# EAGLE schematic CPU (EAGLE 7.5.0), part 1 of 7
RISC CPU
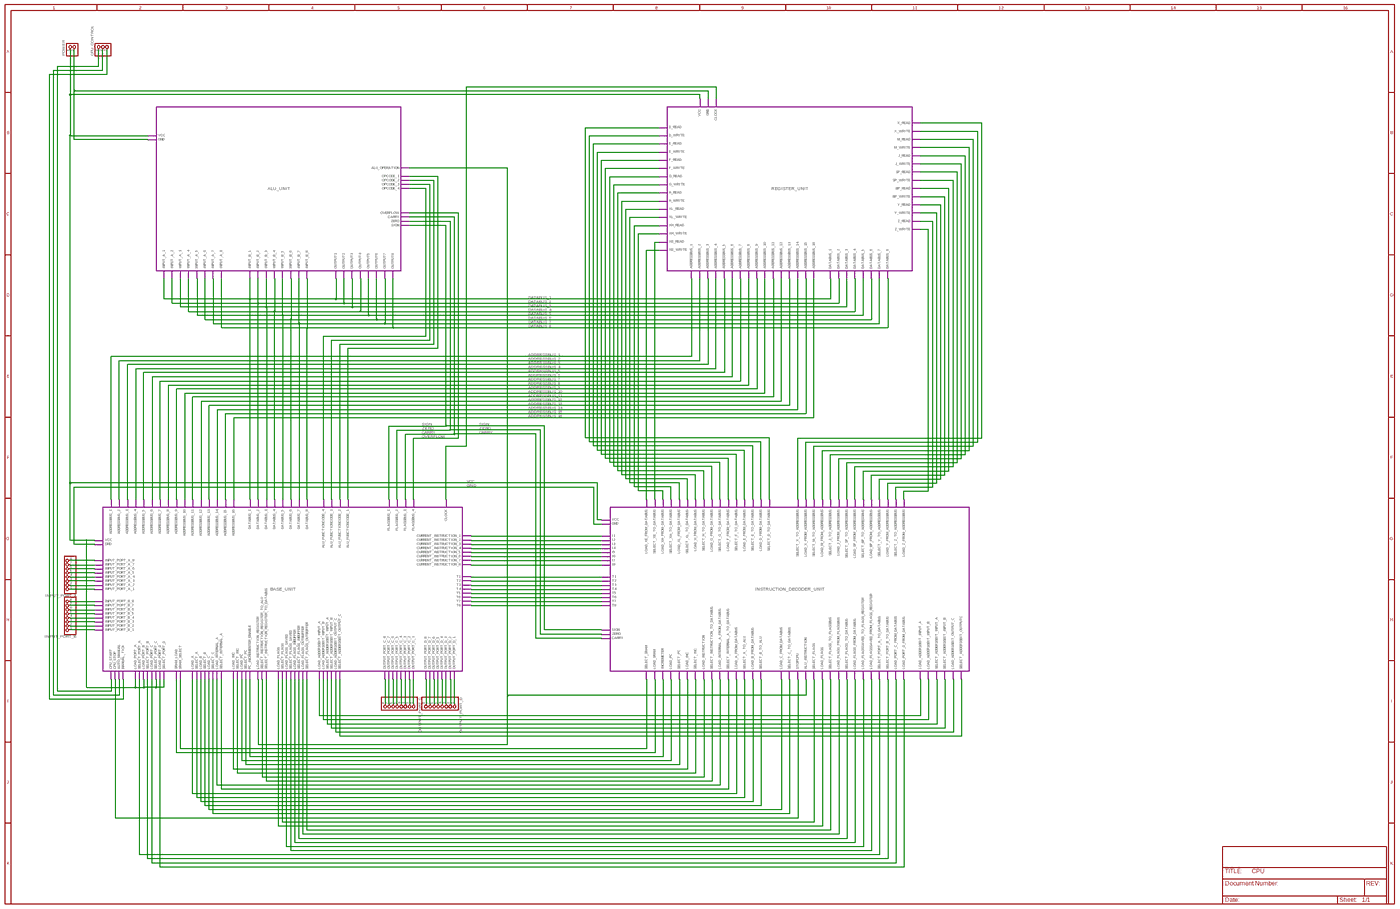
[diagram p0: schematic, sheet 1, overview]
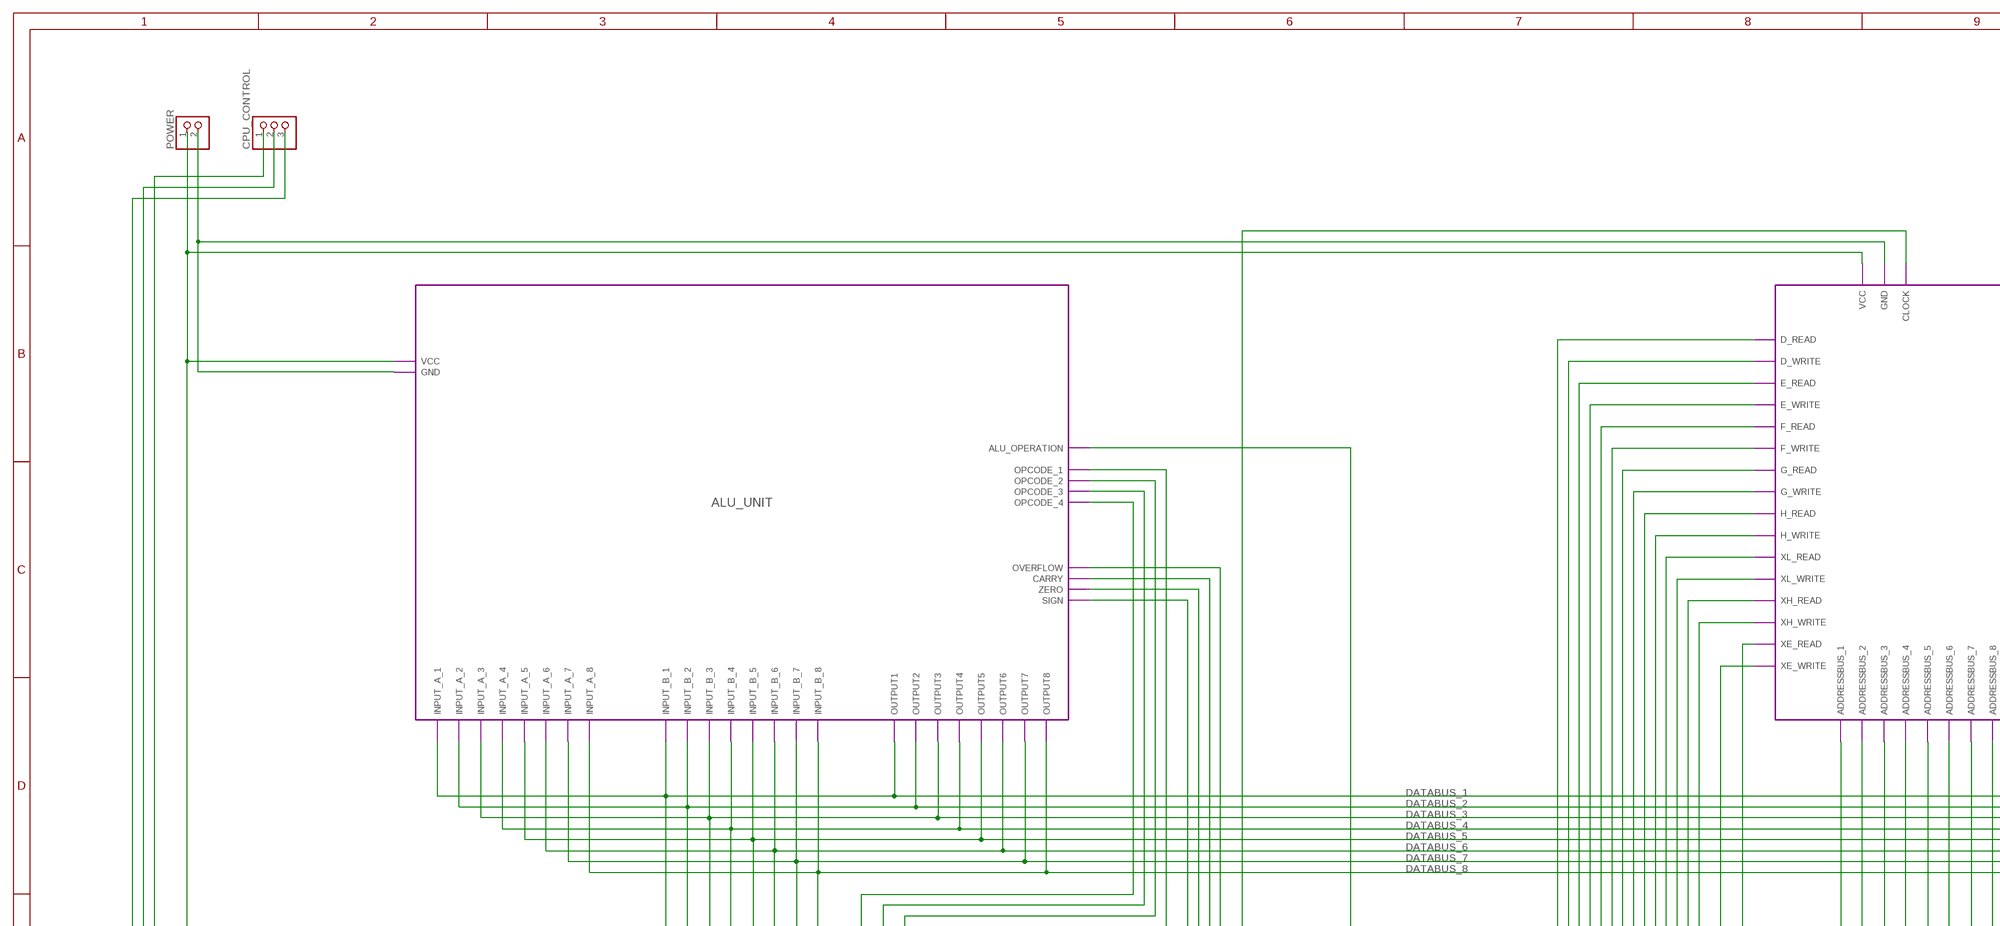
[diagram p1: schematic, sheet 1, part 1 of 4]
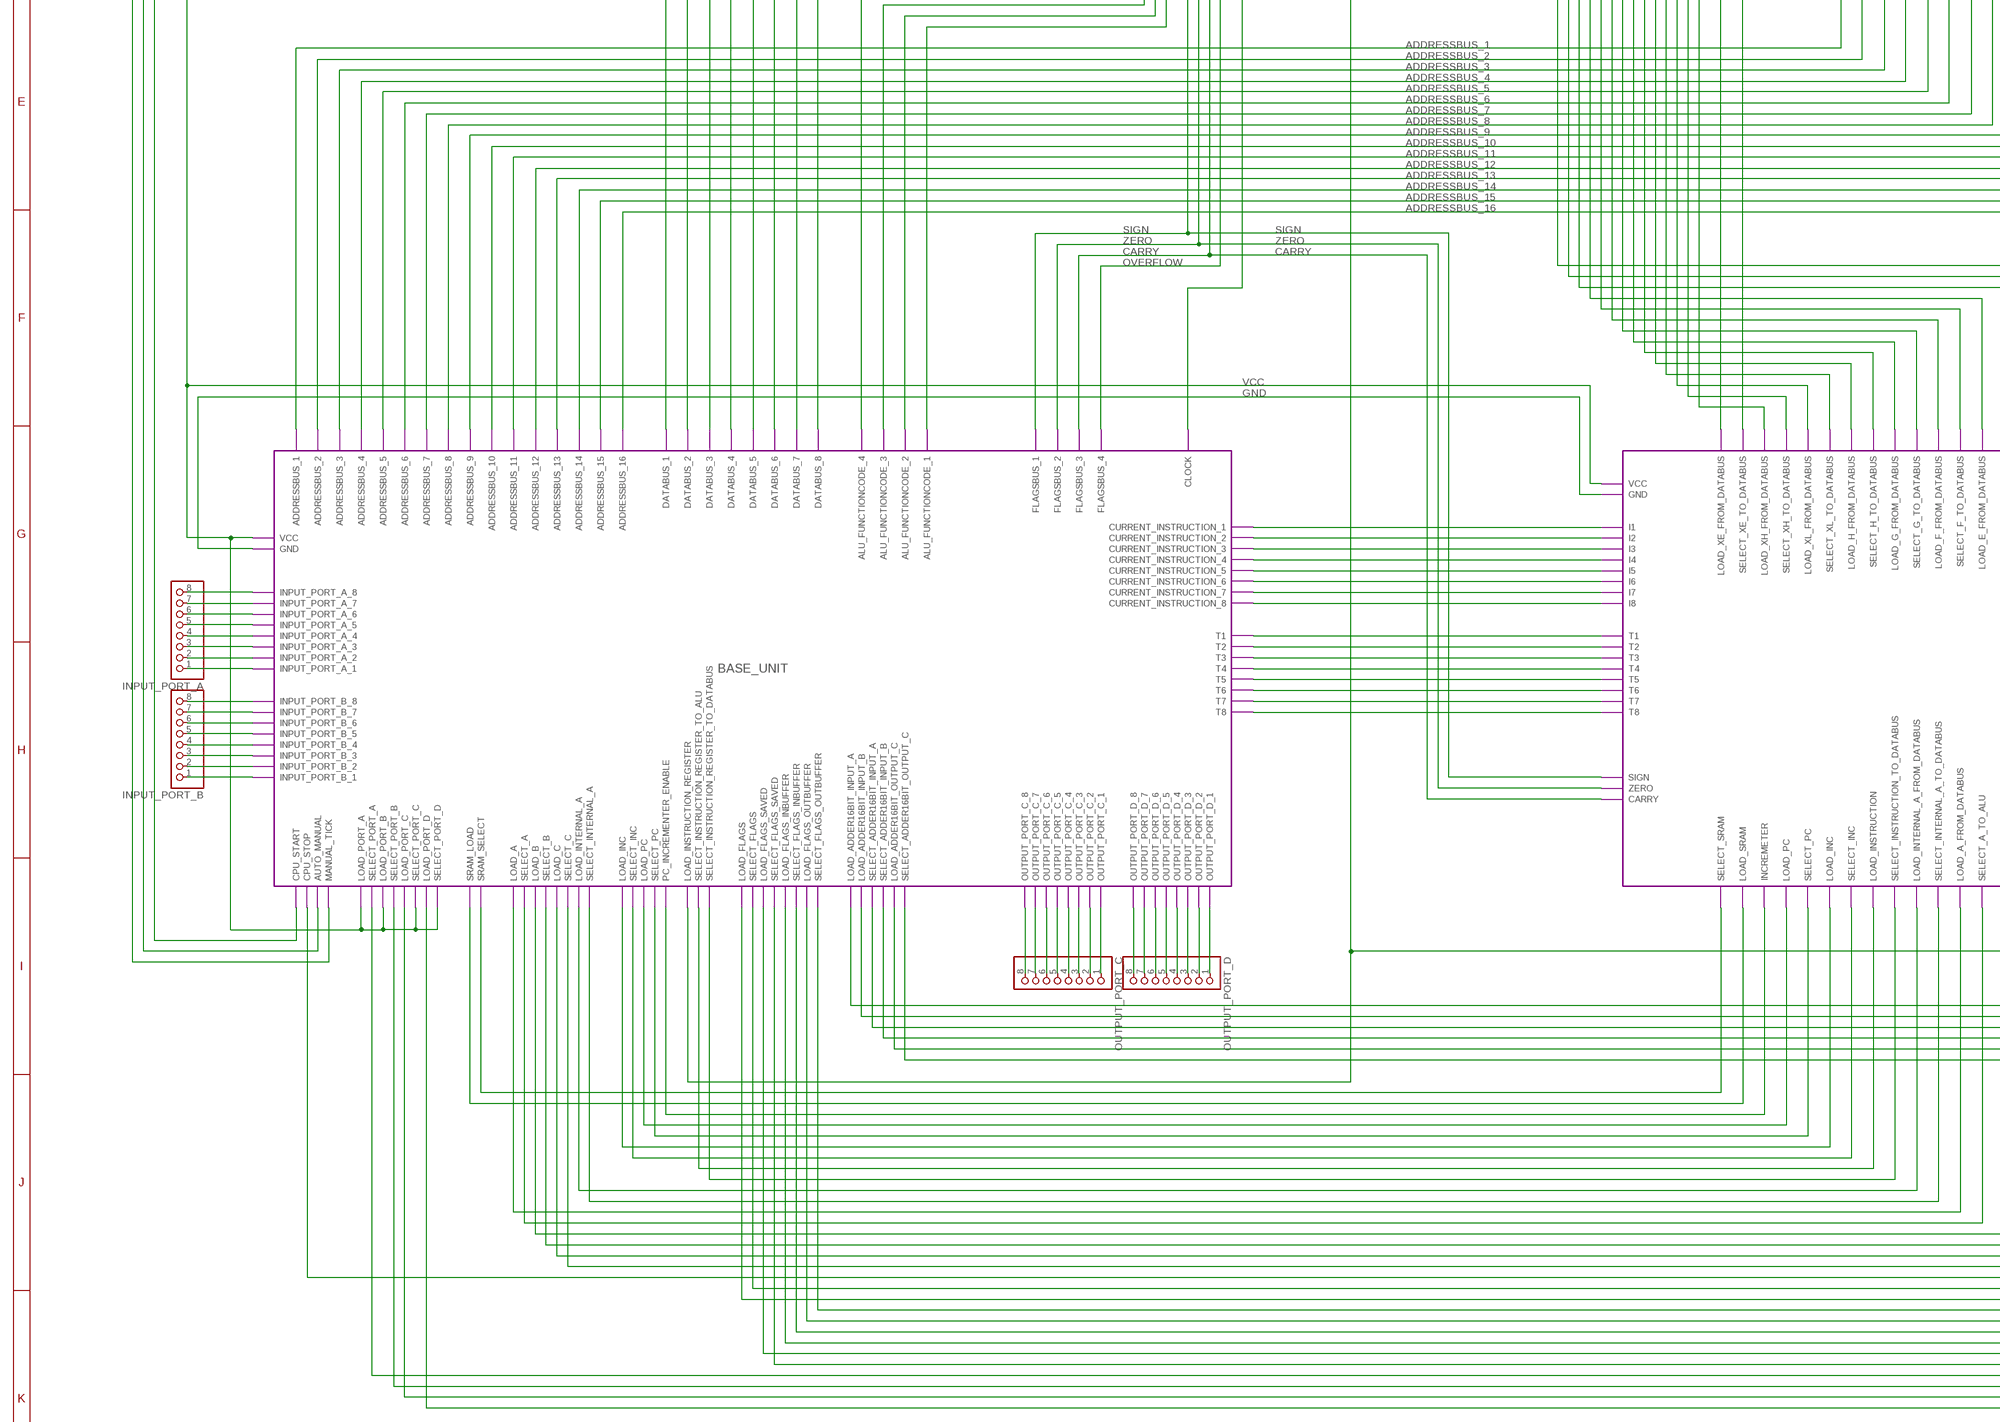
[diagram p2: schematic, sheet 1, part 2 of 4]
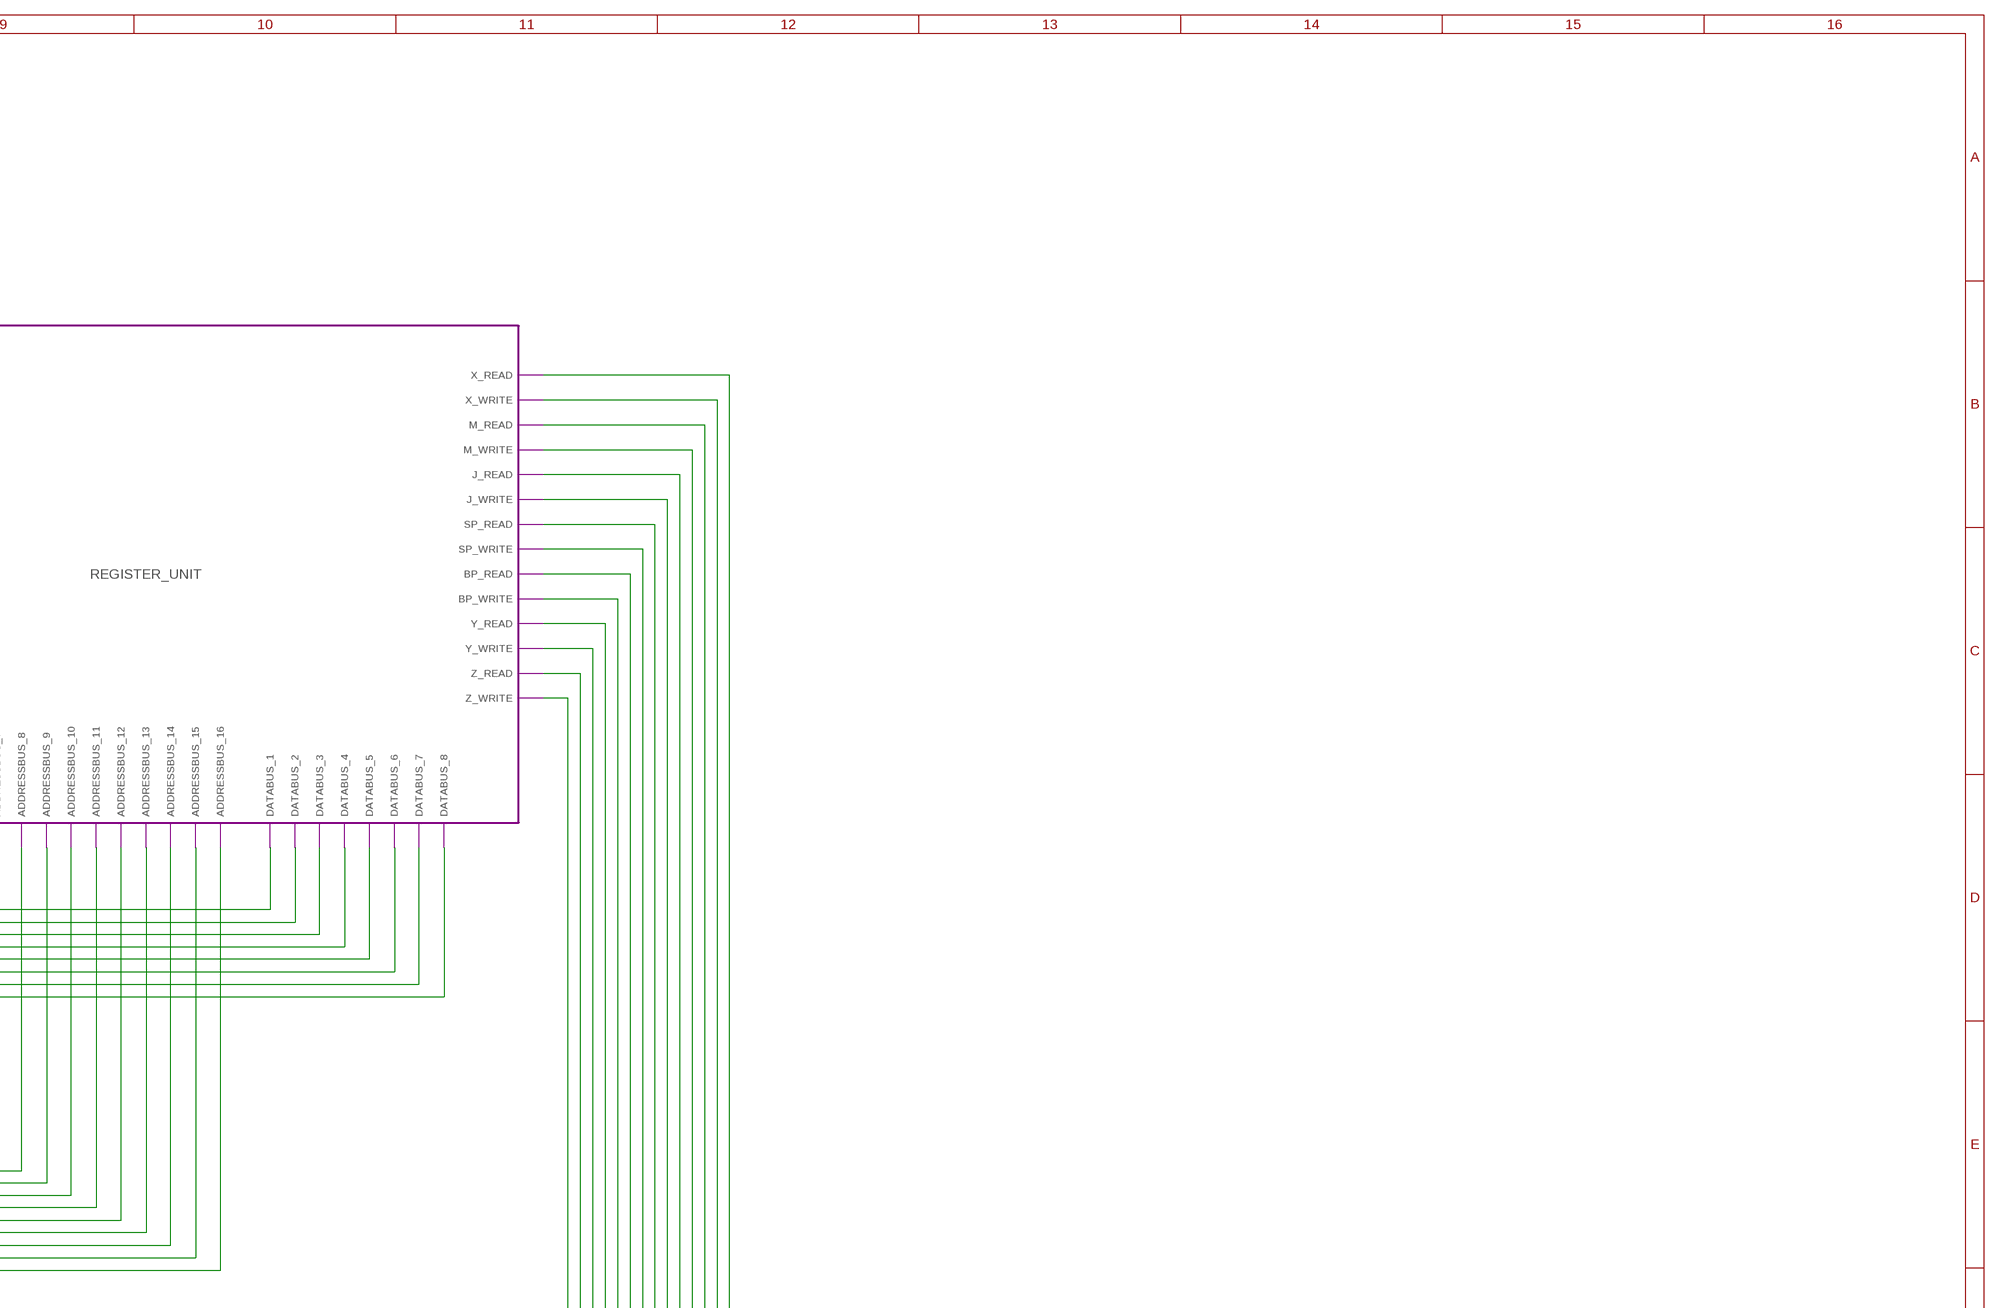
[diagram p3: schematic, sheet 1, part 3 of 4]
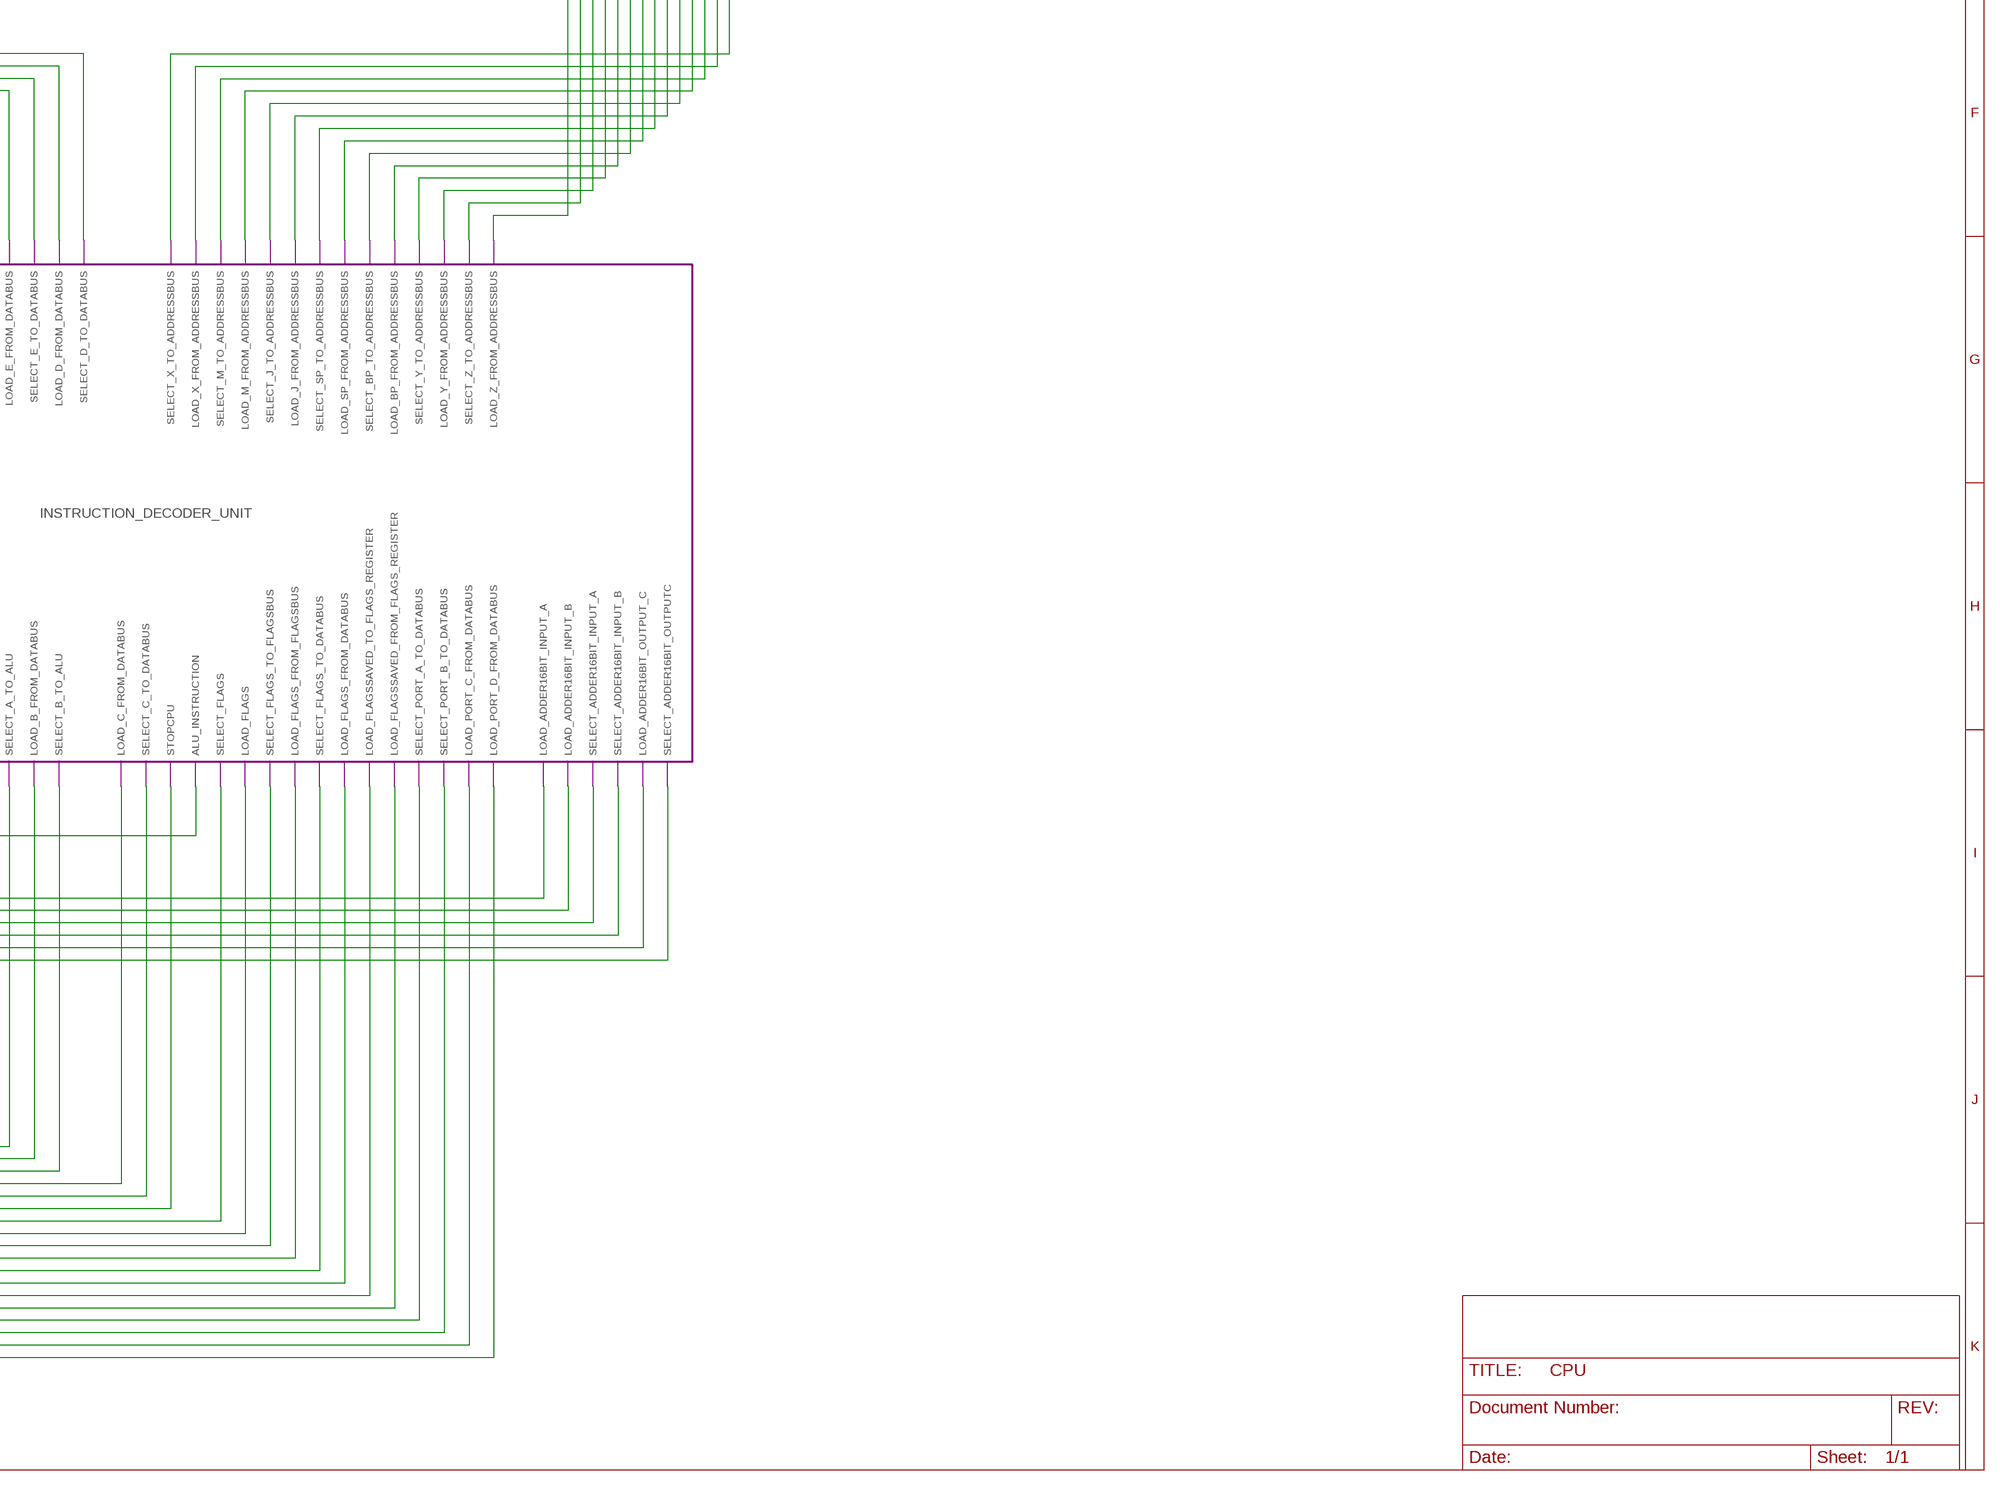
[diagram p4: schematic, sheet 1, part 4 of 4]

## Parts
CPU_CONTROL  PINHD-1X3  [1X03]
INPUT_PORT_A  PINHD-1X8  [1X08]
INPUT_PORT_B  PINHD-1X8  [1X08]
OUTPUT_PORT_C  PINHD-1X8  [1X08]
OUTPUT_PORT_D  PINHD-1X8  [1X08]
POWER  PINHD-1X2  [1X02]

## Module instances
REGISTER_UNIT = REGISTER_UNIT
ALU_UNIT = ALU
INSTRUCTION_DECODER_UNIT = INSTRUCTION_DECODER
BASE_UNIT = BASE

## Nets
ADDRESSBUS_1: port BASE_UNIT.ADDRESSBUS_1 REGISTER_UNIT.ADDRESSBUS_1
ADDRESSBUS_2: port BASE_UNIT.ADDRESSBUS_2 REGISTER_UNIT.ADDRESSBUS_2
ADDRESSBUS_3: port BASE_UNIT.ADDRESSBUS_3 REGISTER_UNIT.ADDRESSBUS_3
ADDRESSBUS_4: port BASE_UNIT.ADDRESSBUS_4 REGISTER_UNIT.ADDRESSBUS_4
ADDRESSBUS_5: port BASE_UNIT.ADDRESSBUS_5 REGISTER_UNIT.ADDRESSBUS_5
ADDRESSBUS_6: port BASE_UNIT.ADDRESSBUS_6 REGISTER_UNIT.ADDRESSBUS_6
ADDRESSBUS_7: port BASE_UNIT.ADDRESSBUS_7 REGISTER_UNIT.ADDRESSBUS_7
ADDRESSBUS_8: port BASE_UNIT.ADDRESSBUS_8 REGISTER_UNIT.ADDRESSBUS_8
ADDRESSBUS_9: port BASE_UNIT.ADDRESSBUS_9 REGISTER_UNIT.ADDRESSBUS_9
ADDRESSBUS_10: port BASE_UNIT.ADDRESSBUS_10 REGISTER_UNIT.ADDRESSBUS_10
ADDRESSBUS_11: port BASE_UNIT.ADDRESSBUS_11 REGISTER_UNIT.ADDRESSBUS_11
ADDRESSBUS_12: port BASE_UNIT.ADDRESSBUS_12 REGISTER_UNIT.ADDRESSBUS_12
ADDRESSBUS_13: port BASE_UNIT.ADDRESSBUS_13 REGISTER_UNIT.ADDRESSBUS_13
ADDRESSBUS_14: port BASE_UNIT.ADDRESSBUS_14 REGISTER_UNIT.ADDRESSBUS_14
ADDRESSBUS_15: port BASE_UNIT.ADDRESSBUS_15 REGISTER_UNIT.ADDRESSBUS_15
ADDRESSBUS_16: port BASE_UNIT.ADDRESSBUS_16 REGISTER_UNIT.ADDRESSBUS_16
AUTO_MANUAL: CPU_CONTROL.2 ; port BASE_UNIT.AUTO_MANUAL
CARRY: port BASE_UNIT.FLAGSBUS_3 ALU_UNIT.CARRY INSTRUCTION_DECODER_UNIT.CARRY
CPU_START: CPU_CONTROL.1 ; port BASE_UNIT.CPU_START
DATABUS_1: port ALU_UNIT.INPUT_A_1 ALU_UNIT.INPUT_B_1 ALU_UNIT.OUTPUT1 BASE_UNIT.DATABUS_1 REGISTER_UNIT.DATABUS_1
DATABUS_2: port ALU_UNIT.INPUT_A_2 ALU_UNIT.INPUT_B_2 ALU_UNIT.OUTPUT2 BASE_UNIT.DATABUS_2 REGISTER_UNIT.DATABUS_2
DATABUS_3: port ALU_UNIT.INPUT_A_3 ALU_UNIT.INPUT_B_3 ALU_UNIT.OUTPUT3 BASE_UNIT.DATABUS_3 REGISTER_UNIT.DATABUS_3
DATABUS_4: port ALU_UNIT.INPUT_A_4 ALU_UNIT.INPUT_B_4 ALU_UNIT.OUTPUT4 BASE_UNIT.DATABUS_4 REGISTER_UNIT.DATABUS_4
DATABUS_5: port ALU_UNIT.INPUT_A_5 ALU_UNIT.INPUT_B_5 ALU_UNIT.OUTPUT5 BASE_UNIT.DATABUS_5 REGISTER_UNIT.DATABUS_5
DATABUS_6: port ALU_UNIT.INPUT_A_6 ALU_UNIT.INPUT_B_6 ALU_UNIT.OUTPUT6 BASE_UNIT.DATABUS_6 REGISTER_UNIT.DATABUS_6
DATABUS_7: port ALU_UNIT.INPUT_A_7 ALU_UNIT.INPUT_B_7 ALU_UNIT.OUTPUT7 BASE_UNIT.DATABUS_7 REGISTER_UNIT.DATABUS_7
DATABUS_8: port ALU_UNIT.INPUT_A_8 ALU_UNIT.INPUT_B_8 ALU_UNIT.OUTPUT8 BASE_UNIT.DATABUS_8 REGISTER_UNIT.DATABUS_8
GND: port BASE_UNIT.GND INSTRUCTION_DECODER_UNIT.GND
INPUT_PORT_A_1: INPUT_PORT_A.1 ; port BASE_UNIT.INPUT_PORT_A_1
INPUT_PORT_A_2: INPUT_PORT_A.2 ; port BASE_UNIT.INPUT_PORT_A_2
INPUT_PORT_A_3: INPUT_PORT_A.3 ; port BASE_UNIT.INPUT_PORT_A_3
INPUT_PORT_A_4: INPUT_PORT_A.4 ; port BASE_UNIT.INPUT_PORT_A_4
INPUT_PORT_A_5: INPUT_PORT_A.5 ; port BASE_UNIT.INPUT_PORT_A_5
INPUT_PORT_A_6: INPUT_PORT_A.6 ; port BASE_UNIT.INPUT_PORT_A_6
INPUT_PORT_A_7: INPUT_PORT_A.7 ; port BASE_UNIT.INPUT_PORT_A_7
INPUT_PORT_A_8: INPUT_PORT_A.8 ; port BASE_UNIT.INPUT_PORT_A_8
INPUT_PORT_B_1: INPUT_PORT_B.1 ; port BASE_UNIT.INPUT_PORT_B_1
INPUT_PORT_B_2: INPUT_PORT_B.2 ; port BASE_UNIT.INPUT_PORT_B_2
INPUT_PORT_B_3: INPUT_PORT_B.3 ; port BASE_UNIT.INPUT_PORT_B_3
INPUT_PORT_B_4: INPUT_PORT_B.4 ; port BASE_UNIT.INPUT_PORT_B_4
INPUT_PORT_B_5: INPUT_PORT_B.5 ; port BASE_UNIT.INPUT_PORT_B_5
INPUT_PORT_B_6: INPUT_PORT_B.6 ; port BASE_UNIT.INPUT_PORT_B_6
INPUT_PORT_B_7: INPUT_PORT_B.7 ; port BASE_UNIT.INPUT_PORT_B_7
INPUT_PORT_B_8: INPUT_PORT_B.8 ; port BASE_UNIT.INPUT_PORT_B_8
MANUAL_TICK: CPU_CONTROL.3 ; port BASE_UNIT.MANUAL_TICK
N$1: port BASE_UNIT.CURRENT_INSTRUCTION_1 INSTRUCTION_DECODER_UNIT.I1
N$2: port BASE_UNIT.CURRENT_INSTRUCTION_2 INSTRUCTION_DECODER_UNIT.I2
N$3: port BASE_UNIT.CURRENT_INSTRUCTION_3 INSTRUCTION_DECODER_UNIT.I3
N$4: port BASE_UNIT.CURRENT_INSTRUCTION_4 INSTRUCTION_DECODER_UNIT.I4
N$5: port BASE_UNIT.CURRENT_INSTRUCTION_5 INSTRUCTION_DECODER_UNIT.I5
N$6: port BASE_UNIT.CURRENT_INSTRUCTION_6 INSTRUCTION_DECODER_UNIT.I6
N$7: port BASE_UNIT.CURRENT_INSTRUCTION_7 INSTRUCTION_DECODER_UNIT.I7
N$8: port BASE_UNIT.CURRENT_INSTRUCTION_8 INSTRUCTION_DECODER_UNIT.I8
N$9: port BASE_UNIT.T1 INSTRUCTION_DECODER_UNIT.T1
N$10: port BASE_UNIT.T2 INSTRUCTION_DECODER_UNIT.T2
N$11: port BASE_UNIT.T3 INSTRUCTION_DECODER_UNIT.T3
N$12: port BASE_UNIT.T4 INSTRUCTION_DECODER_UNIT.T4
N$13: port BASE_UNIT.T5 INSTRUCTION_DECODER_UNIT.T5
N$14: port BASE_UNIT.T6 INSTRUCTION_DECODER_UNIT.T6
N$15: port BASE_UNIT.T7 INSTRUCTION_DECODER_UNIT.T7
N$16: port BASE_UNIT.T8 INSTRUCTION_DECODER_UNIT.T8
N$17: POWER.2 ; port REGISTER_UNIT.GND ALU_UNIT.GND
N$73: port BASE_UNIT.ALU_FUNCTIONCODE_1 ALU_UNIT.OPCODE_1
N$74: port BASE_UNIT.ALU_FUNCTIONCODE_2 ALU_UNIT.OPCODE_2
N$75: port BASE_UNIT.ALU_FUNCTIONCODE_3 ALU_UNIT.OPCODE_3
N$76: port BASE_UNIT.ALU_FUNCTIONCODE_4 ALU_UNIT.OPCODE_4
N$81: port INSTRUCTION_DECODER_UNIT.LOAD_XE_FROM_DATABUS REGISTER_UNIT.XE_WRITE
N$82: port INSTRUCTION_DECODER_UNIT.SELECT_XE_TO_DATABUS REGISTER_UNIT.XE_READ
N$83: port INSTRUCTION_DECODER_UNIT.LOAD_XH_FROM_DATABUS REGISTER_UNIT.XH_WRITE
N$84: port INSTRUCTION_DECODER_UNIT.SELECT_XH_TO_DATABUS REGISTER_UNIT.XH_READ
N$85: port INSTRUCTION_DECODER_UNIT.LOAD_XL_FROM_DATABUS REGISTER_UNIT.XL_WRITE
N$86: port INSTRUCTION_DECODER_UNIT.SELECT_XL_TO_DATABUS REGISTER_UNIT.XL_READ
N$87: port INSTRUCTION_DECODER_UNIT.LOAD_H_FROM_DATABUS REGISTER_UNIT.H_WRITE
N$88: port INSTRUCTION_DECODER_UNIT.SELECT_H_TO_DATABUS REGISTER_UNIT.H_READ
N$89: port INSTRUCTION_DECODER_UNIT.LOAD_G_FROM_DATABUS REGISTER_UNIT.G_WRITE
N$90: port INSTRUCTION_DECODER_UNIT.SELECT_G_TO_DATABUS REGISTER_UNIT.G_READ
N$91: port INSTRUCTION_DECODER_UNIT.LOAD_F_FROM_DATABUS REGISTER_UNIT.F_WRITE
N$92: port INSTRUCTION_DECODER_UNIT.SELECT_F_TO_DATABUS REGISTER_UNIT.F_READ
N$93: port INSTRUCTION_DECODER_UNIT.LOAD_E_FROM_DATABUS REGISTER_UNIT.E_WRITE
N$94: port INSTRUCTION_DECODER_UNIT.SELECT_E_TO_DATABUS REGISTER_UNIT.E_READ
N$95: port INSTRUCTION_DECODER_UNIT.LOAD_D_FROM_DATABUS REGISTER_UNIT.D_WRITE
N$96: port INSTRUCTION_DECODER_UNIT.SELECT_D_TO_DATABUS REGISTER_UNIT.D_READ
N$97: port INSTRUCTION_DECODER_UNIT.LOAD_Z_FROM_ADDRESSBUS REGISTER_UNIT.Z_WRITE
N$98: port INSTRUCTION_DECODER_UNIT.SELECT_Z_TO_ADDRESSBUS REGISTER_UNIT.Z_READ
N$99: port INSTRUCTION_DECODER_UNIT.LOAD_Y_FROM_ADDRESSBUS REGISTER_UNIT.Y_WRITE
N$100: port INSTRUCTION_DECODER_UNIT.SELECT_Y_TO_ADDRESSBUS REGISTER_UNIT.Y_READ
N$101: port INSTRUCTION_DECODER_UNIT.LOAD_BP_FROM_ADDRESSBUS REGISTER_UNIT.BP_WRITE
N$102: port INSTRUCTION_DECODER_UNIT.SELECT_BP_TO_ADDRESSBUS REGISTER_UNIT.BP_READ
N$103: port INSTRUCTION_DECODER_UNIT.LOAD_SP_FROM_ADDRESSBUS REGISTER_UNIT.SP_WRITE
N$104: port INSTRUCTION_DECODER_UNIT.SELECT_SP_TO_ADDRESSBUS REGISTER_UNIT.SP_READ
N$105: port INSTRUCTION_DECODER_UNIT.LOAD_J_FROM_ADDRESSBUS REGISTER_UNIT.J_WRITE
N$106: port INSTRUCTION_DECODER_UNIT.SELECT_J_TO_ADDRESSBUS REGISTER_UNIT.J_READ
N$107: port INSTRUCTION_DECODER_UNIT.LOAD_M_FROM_ADDRESSBUS REGISTER_UNIT.M_WRITE
N$108: port INSTRUCTION_DECODER_UNIT.SELECT_M_TO_ADDRESSBUS REGISTER_UNIT.M_READ
N$109: port INSTRUCTION_DECODER_UNIT.LOAD_X_FROM_ADDRESSBUS REGISTER_UNIT.X_WRITE
N$110: port INSTRUCTION_DECODER_UNIT.SELECT_X_TO_ADDRESSBUS REGISTER_UNIT.X_READ
N$111: port BASE_UNIT.CLOCK REGISTER_UNIT.CLOCK
N$112: port INSTRUCTION_DECODER_UNIT.SELECT_SRAM BASE_UNIT.SRAM_SELECT
N$113: port INSTRUCTION_DECODER_UNIT.LOAD_SRAM BASE_UNIT.SRAM_LOAD
N$114: port INSTRUCTION_DECODER_UNIT.INCREMETER BASE_UNIT.PC_INCREMENTER_ENABLE
N$115: port INSTRUCTION_DECODER_UNIT.LOAD_PC BASE_UNIT.LOAD_PC
N$116: port INSTRUCTION_DECODER_UNIT.SELECT_PC BASE_UNIT.SELECT_PC
N$117: port INSTRUCTION_DECODER_UNIT.LOAD_INC BASE_UNIT.LOAD_INC
N$118: port INSTRUCTION_DECODER_UNIT.SELECT_INC BASE_UNIT.SELECT_INC
N$119: port INSTRUCTION_DECODER_UNIT.LOAD_INSTRUCTION BASE_UNIT.SELECT_INSTRUCTION_REGISTER_TO_ALU
N$120: port INSTRUCTION_DECODER_UNIT.SELECT_INSTRUCTION_TO_DATABUS BASE_UNIT.SELECT_INSTRUCTION_REGISTER_TO_DATABUS
N$121: port INSTRUCTION_DECODER_UNIT.LOAD_INTERNAL_A_FROM_DATABUS BASE_UNIT.LOAD_INTERNAL_A
N$122: port INSTRUCTION_DECODER_UNIT.SELECT_INTERNAL_A_TO_DATABUS BASE_UNIT.SELECT_INTERNAL_A
N$123: port INSTRUCTION_DECODER_UNIT.LOAD_A_FROM_DATABUS BASE_UNIT.LOAD_A
N$124: port INSTRUCTION_DECODER_UNIT.SELECT_A_TO_ALU BASE_UNIT.SELECT_A
N$125: port INSTRUCTION_DECODER_UNIT.LOAD_B_FROM_DATABUS BASE_UNIT.LOAD_B
N$126: port INSTRUCTION_DECODER_UNIT.SELECT_B_TO_ALU BASE_UNIT.SELECT_B
N$127: port INSTRUCTION_DECODER_UNIT.LOAD_C_FROM_DATABUS BASE_UNIT.LOAD_C
N$128: port INSTRUCTION_DECODER_UNIT.SELECT_C_TO_DATABUS BASE_UNIT.SELECT_C
N$129: port INSTRUCTION_DECODER_UNIT.STOPCPU BASE_UNIT.CPU_STOP
N$130: port INSTRUCTION_DECODER_UNIT.ALU_INSTRUCTION ALU_UNIT.ALU_OPERATION BASE_UNIT.LOAD_INSTRUCTION_REGISTER
N$131: port INSTRUCTION_DECODER_UNIT.SELECT_FLAGS BASE_UNIT.SELECT_FLAGS
N$132: port INSTRUCTION_DECODER_UNIT.LOAD_FLAGS BASE_UNIT.LOAD_FLAGS
N$133: port INSTRUCTION_DECODER_UNIT.SELECT_FLAGS_TO_FLAGSBUS BASE_UNIT.SELECT_FLAGS_OUTBUFFER
N$134: port INSTRUCTION_DECODER_UNIT.LOAD_FLAGS_FROM_FLAGSBUS BASE_UNIT.LOAD_FLAGS_OUTBUFFER
N$135: port INSTRUCTION_DECODER_UNIT.SELECT_FLAGS_TO_DATABUS BASE_UNIT.SELECT_FLAGS_INBUFFER
N$136: port INSTRUCTION_DECODER_UNIT.LOAD_FLAGS_FROM_DATABUS BASE_UNIT.LOAD_FLAGS_INBUFFER
N$137: port INSTRUCTION_DECODER_UNIT.LOAD_FLAGSSAVED_TO_FLAGS_REGISTER BASE_UNIT.LOAD_FLAGS_SAVED
N$138: port INSTRUCTION_DECODER_UNIT.LOAD_FLAGSSAVED_FROM_FLAGS_REGISTER BASE_UNIT.SELECT_FLAGS_SAVED
N$139: port INSTRUCTION_DECODER_UNIT.SELECT_PORT_A_TO_DATABUS BASE_UNIT.SELECT_PORT_A
N$140: port INSTRUCTION_DECODER_UNIT.SELECT_PORT_B_TO_DATABUS BASE_UNIT.SELECT_PORT_B
N$141: port INSTRUCTION_DECODER_UNIT.LOAD_PORT_C_FROM_DATABUS BASE_UNIT.LOAD_PORT_C
N$142: port INSTRUCTION_DECODER_UNIT.LOAD_PORT_D_FROM_DATABUS BASE_UNIT.LOAD_PORT_D
N$144: port INSTRUCTION_DECODER_UNIT.LOAD_ADDER16BIT_INPUT_A BASE_UNIT.LOAD_ADDER16BIT_INPUT_A
N$145: port INSTRUCTION_DECODER_UNIT.LOAD_ADDER16BIT_INPUT_B BASE_UNIT.LOAD_ADDER16BIT_INPUT_B
N$146: port INSTRUCTION_DECODER_UNIT.SELECT_ADDER16BIT_INPUT_A BASE_UNIT.SELECT_ADDER16BIT_INPUT_A
N$147: port INSTRUCTION_DECODER_UNIT.SELECT_ADDER16BIT_INPUT_B BASE_UNIT.SELECT_ADDER16BIT_INPUT_B
N$148: port INSTRUCTION_DECODER_UNIT.LOAD_ADDER16BIT_OUTPUT_C BASE_UNIT.LOAD_ADDER16BIT_OUTPUT_C
N$149: port INSTRUCTION_DECODER_UNIT.SELECT_ADDER16BIT_OUTPUTC BASE_UNIT.SELECT_ADDER16BIT_OUTPUT_C
OUTPUT_PORT_C_1: OUTPUT_PORT_C.1 ; port BASE_UNIT.OUTPUT_PORT_C_1
OUTPUT_PORT_C_2: OUTPUT_PORT_C.2 ; port BASE_UNIT.OUTPUT_PORT_C_2
OUTPUT_PORT_C_3: OUTPUT_PORT_C.3 ; port BASE_UNIT.OUTPUT_PORT_C_3
OUTPUT_PORT_C_4: OUTPUT_PORT_C.4 ; port BASE_UNIT.OUTPUT_PORT_C_4
OUTPUT_PORT_C_5: OUTPUT_PORT_C.5 ; port BASE_UNIT.OUTPUT_PORT_C_5
OUTPUT_PORT_C_6: OUTPUT_PORT_C.6 ; port BASE_UNIT.OUTPUT_PORT_C_6
OUTPUT_PORT_C_7: OUTPUT_PORT_C.7 ; port BASE_UNIT.OUTPUT_PORT_C_7
OUTPUT_PORT_C_8: OUTPUT_PORT_C.8 ; port BASE_UNIT.OUTPUT_PORT_C_8
OUTPUT_PORT_D_1: OUTPUT_PORT_D.1 ; port BASE_UNIT.OUTPUT_PORT_D_1
OUTPUT_PORT_D_2: OUTPUT_PORT_D.2 ; port BASE_UNIT.OUTPUT_PORT_D_2
OUTPUT_PORT_D_3: OUTPUT_PORT_D.3 ; port BASE_UNIT.OUTPUT_PORT_D_3
OUTPUT_PORT_D_4: OUTPUT_PORT_D.4 ; port BASE_UNIT.OUTPUT_PORT_D_4
OUTPUT_PORT_D_5: OUTPUT_PORT_D.5 ; port BASE_UNIT.OUTPUT_PORT_D_5
OUTPUT_PORT_D_6: OUTPUT_PORT_D.6 ; port BASE_UNIT.OUTPUT_PORT_D_6
OUTPUT_PORT_D_7: OUTPUT_PORT_D.7 ; port BASE_UNIT.OUTPUT_PORT_D_7
OUTPUT_PORT_D_8: OUTPUT_PORT_D.8 ; port BASE_UNIT.OUTPUT_PORT_D_8
OVERFLOW: port BASE_UNIT.FLAGSBUS_4 ALU_UNIT.OVERFLOW
SIGN: port BASE_UNIT.FLAGSBUS_1 ALU_UNIT.SIGN INSTRUCTION_DECODER_UNIT.SIGN
VCC: POWER.1 ; port ALU_UNIT.VCC REGISTER_UNIT.VCC BASE_UNIT.VCC INSTRUCTION_DECODER_UNIT.VCC BASE_UNIT.LOAD_PORT_A BASE_UNIT.SELECT_PORT_D BASE_UNIT.SELECT_PORT_C BASE_UNIT.LOAD_PORT_B
ZERO: port BASE_UNIT.FLAGSBUS_2 ALU_UNIT.ZERO INSTRUCTION_DECODER_UNIT.ZERO

## Library data of the parts
CPU_CONTROL = pinhead:PINHD-1X3: PIN HEADER
INPUT_PORT_A INPUT_PORT_B OUTPUT_PORT_C OUTPUT_PORT_D = pinhead:PINHD-1X8: PIN HEADER
POWER = pinhead:PINHD-1X2: PIN HEADER

## Module REGISTER
Ports: INPUT_1(in) INPUT_2(in) INPUT_3(in) INPUT_4(in) INPUT_5(in) INPUT_6(in) INPUT_7(in) INPUT_8(in) OUTPUT_1(out) OUTPUT_2(out) OUTPUT_3(out) OUTPUT_4(out) OUTPUT_5(out) OUTPUT_6(out) OUTPUT_7(out) OUTPUT_8(out) CLOCK(in) WRITE(in) READ(in) VCC(in) GND(in)
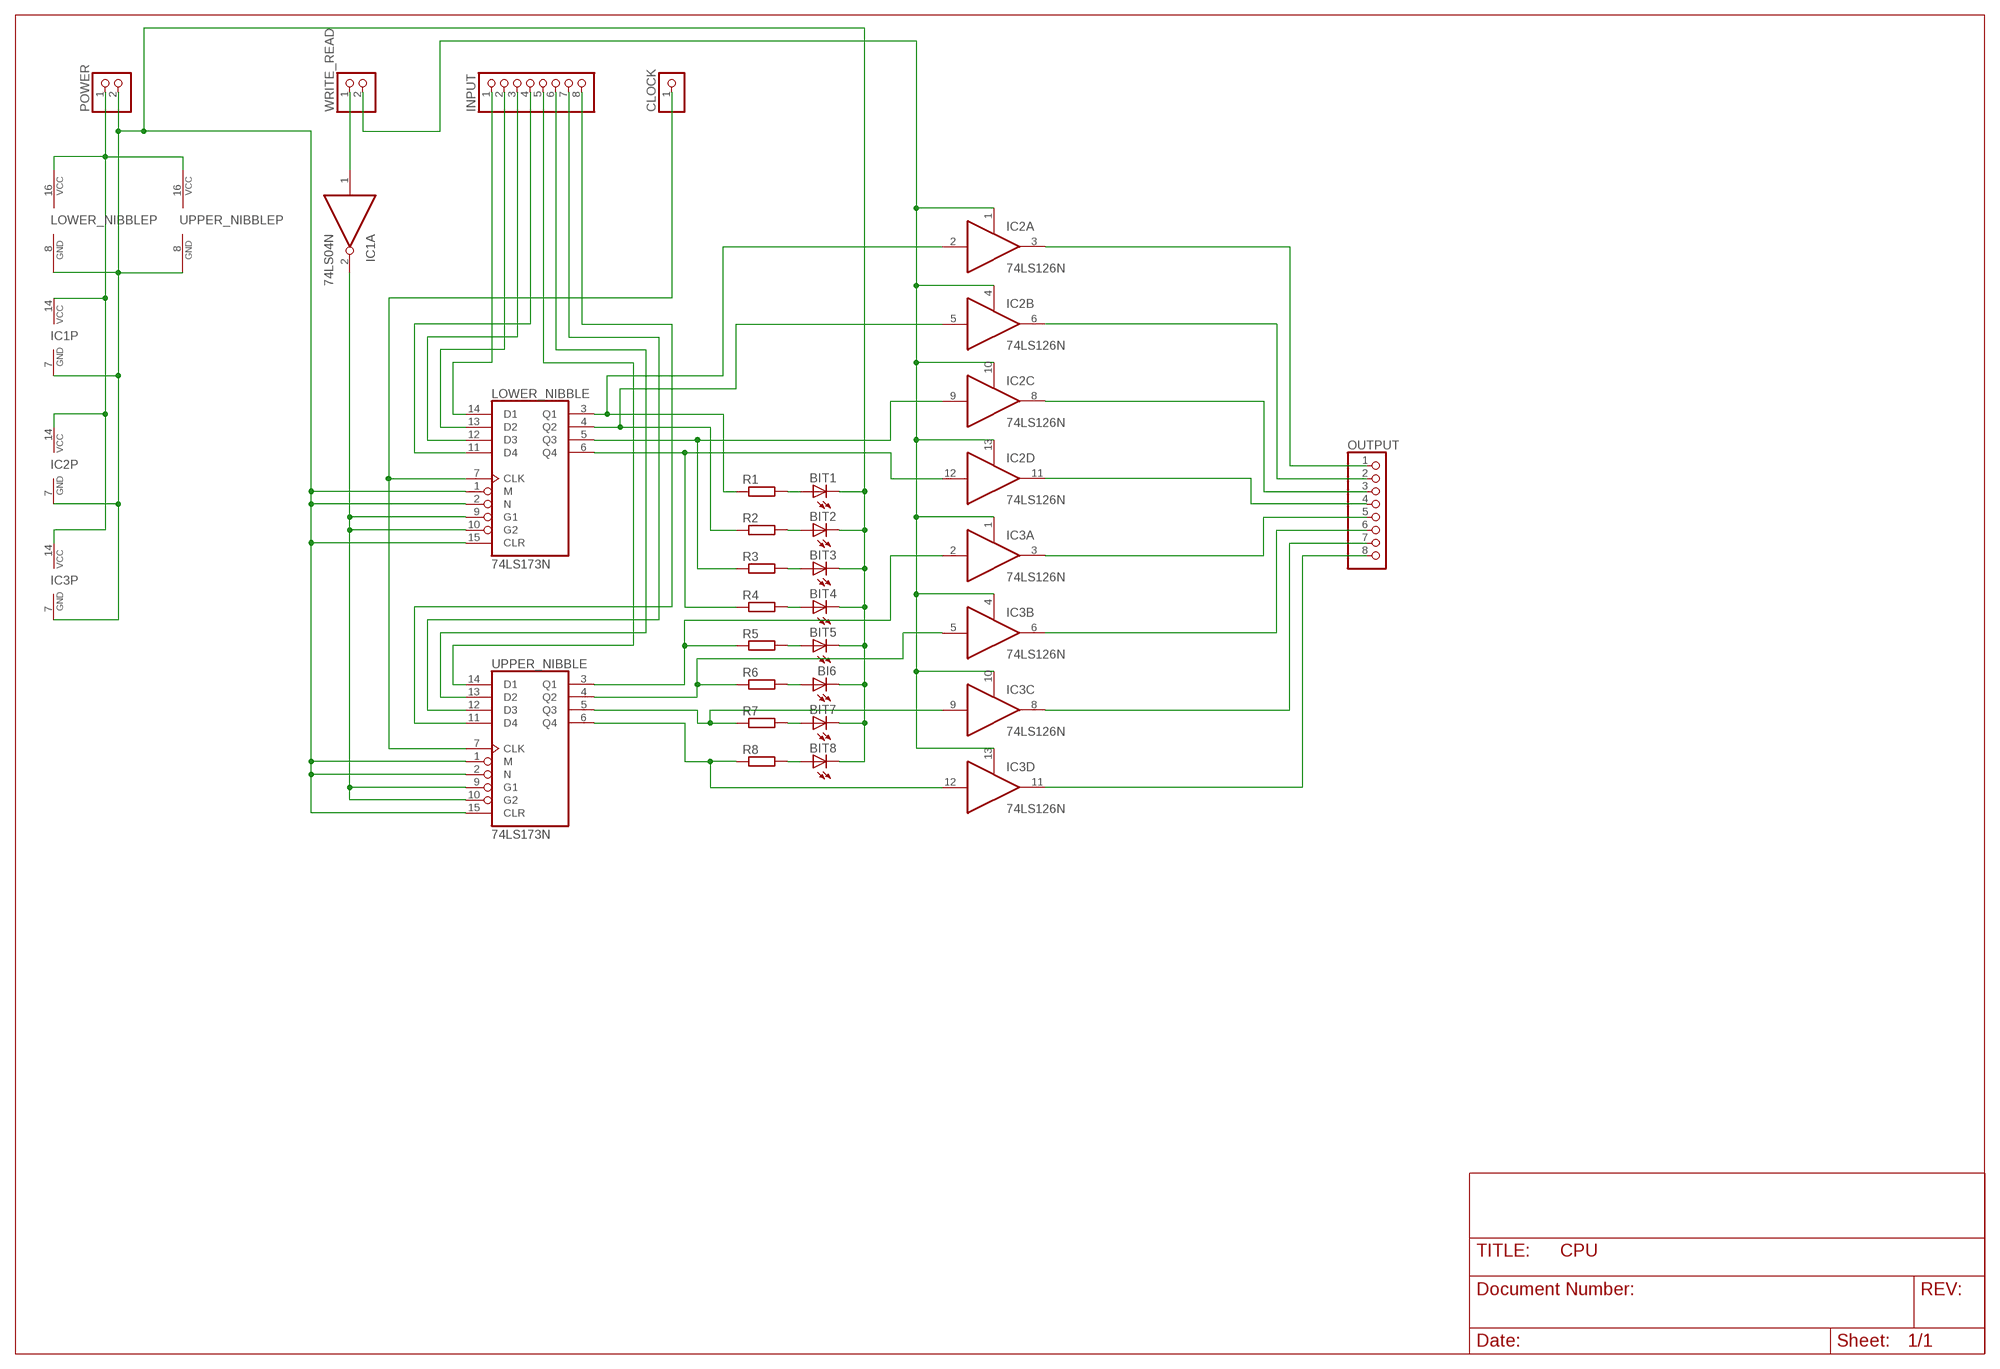
[diagram p5: schematic, module REGISTER, sheet 1]

### Parts
BI6  LED3MM  [LED3MM]
BIT1  LED3MM  [LED3MM]
BIT2  LED3MM  [LED3MM]
BIT3  LED3MM  [LED3MM]
BIT4  LED3MM  [LED3MM]
BIT5  LED3MM  [LED3MM]
BIT7  LED3MM  [LED3MM]
BIT8  LED3MM  [LED3MM]
CLOCK  PINHD-1X1  [1X01]
IC1  74LS04N  [DIL14]
IC2  74LS126N  [DIL14]
IC3  74LS126N  [DIL14]
INPUT  PINHD-1X8  [1X08]
LOWER_NIBBLE  74LS173N  [DIL16]
OUTPUT  PINHD-1X8  [1X08]
POWER  PINHD-1X2  [1X02]
R1  R-EU_0207/10  [0207/10]
R2  R-EU_0207/10  [0207/10]
R3  R-EU_0207/10  [0207/10]
R4  R-EU_0207/10  [0207/10]
R5  R-EU_0207/10  [0207/10]
R6  R-EU_0207/10  [0207/10]
R7  R-EU_0207/10  [0207/10]
R8  R-EU_0207/10  [0207/10]
UPPER_NIBBLE  74LS173N  [DIL16]
WRITE_READ  PINHD-1X2  [1X02]

### Nets
CLOCK: CLOCK.1 LOWER_NIBBLE.7(CLK) UPPER_NIBBLE.7(CLK)
GND: BI6.K(C) BIT1.K(C) BIT2.K(C) BIT3.K(C) BIT4.K(C) BIT5.K(C) BIT7.K(C) BIT8.K(C) IC1.7(P:GND) IC2.7(P:GND) IC3.7(P:GND) LOWER_NIBBLE.1(M) LOWER_NIBBLE.2(N) LOWER_NIBBLE.8(GND) LOWER_NIBBLE.15(CLR) POWER.2 UPPER_NIBBLE.1(M) UPPER_NIBBLE.2(N) UPPER_NIBBLE.8(GND) UPPER_NIBBLE.15(CLR)
INPUT_1: INPUT.1 LOWER_NIBBLE.14(D1)
INPUT_2: INPUT.2 LOWER_NIBBLE.13(D2)
INPUT_3: INPUT.3 LOWER_NIBBLE.12(D3)
INPUT_4: INPUT.4 LOWER_NIBBLE.11(D4)
INPUT_5: INPUT.5 UPPER_NIBBLE.14(D1)
INPUT_6: INPUT.6 UPPER_NIBBLE.13(D2)
INPUT_7: INPUT.7 UPPER_NIBBLE.12(D3)
INPUT_8: INPUT.8 UPPER_NIBBLE.11(D4)
N$1: BIT8.A R8.2
N$3: BIT1.A R1.2
N$5: BIT2.A R2.2
N$6: BIT3.A R3.2
N$7: BIT4.A R4.2
N$8: BIT5.A R5.2
N$9: BI6.A R6.2
N$10: BIT7.A R7.2
N$12: IC1.2(A:O) LOWER_NIBBLE.9(G1) LOWER_NIBBLE.10(G2) UPPER_NIBBLE.9(G1) UPPER_NIBBLE.10(G2)
N$22: IC2.2(A:I) LOWER_NIBBLE.3(Q1) R1.1
N$23: IC2.5(B:I) LOWER_NIBBLE.4(Q2) R2.1
N$24: IC2.9(C:I) LOWER_NIBBLE.5(Q3) R3.1
N$25: IC2.12(D:I) LOWER_NIBBLE.6(Q4) R4.1
N$26: IC3.2(A:I) R5.1 UPPER_NIBBLE.3(Q1)
N$27: IC3.5(B:I) R6.1 UPPER_NIBBLE.4(Q2)
N$28: IC3.9(C:I) R7.1 UPPER_NIBBLE.5(Q3)
N$29: IC3.12(D:I) R8.1 UPPER_NIBBLE.6(Q4)
OUTPUT_1: IC2.3(A:O) OUTPUT.1
OUTPUT_2: IC2.6(B:O) OUTPUT.2
OUTPUT_3: IC2.8(C:O) OUTPUT.3
OUTPUT_4: IC2.11(D:O) OUTPUT.4
OUTPUT_5: IC3.3(A:O) OUTPUT.5
OUTPUT_6: IC3.6(B:O) OUTPUT.6
OUTPUT_7: IC3.8(C:O) OUTPUT.7
OUTPUT_8: IC3.11(D:O) OUTPUT.8
READ: IC2.1(A:OE) IC2.4(B:OE) IC2.10(C:OE) IC2.13(D:OE) IC3.1(A:OE) IC3.4(B:OE) IC3.10(C:OE) IC3.13(D:OE) WRITE_READ.2
VCC: IC1.14(P:VCC) IC2.14(P:VCC) IC3.14(P:VCC) LOWER_NIBBLE.16(VCC) POWER.1 UPPER_NIBBLE.16(VCC)
WRITE: IC1.1(A:I) WRITE_READ.1
Unconnected: IC1.3(B:I) IC1.4(B:O) IC1.5(C:I) IC1.6(C:O) IC1.8(D:O) IC1.9(D:I) IC1.10(E:O) IC1.11(E:I) IC1.12(F:O) IC1.13(F:I)

### Library data of the parts
BI6 BIT1-BIT5 BIT7 BIT8 = led:LED: LED OSRAM: - CHIPLED LG R971, LG N971, LY N971, LG Q971, LY Q971, LO R971, LY R971 LH N974, LH R974 LS Q976, LO Q976, LY Q976 LO Q996 - Hyper CHIPLED LW Q18S LB Q993, LB Q99A, LB R99A - SideLED LS A670, LO A670, LY A670, LG A670, LP A670 LB A673, LV A673, LT A673, LW A673 LH A674 LY A675 LS A676, LA A676, LO A676, LY A676, LW A676 LS A679, LY A679, LG A679 - Hyper Micro SIDELED® LS Y876, LA Y876, LO Y876, LY Y876 LT Y87S - SmartLED LW L88C, LW L88S LB L89C, LB L89S, LG L890 LS L89K, LO L89K, LY L89K LS L896, LA L896, LO L896, LY L896 - TOPLED LS T670, LO T670, LY T670, LG T670, LP T670 LSG T670, LSP T670, LSY T670, LOP T670, LYG T670 LG T671, LOG T671, LSG T671 LB T673, LV T673, LT T673, LW T673 LH T674 LS T676, LA T676, LO T676, LY T676, LB T676, LH T676, LSB T676, LW T676 LB T67C, LV T67C, LT T67C, LS T67K, LO T67K, LY T67K, LW E67C LS E67B, LA E67B, LO E67B, LY E67B, LB E67C, LV E67C, LT E67C LW T67C LS T679, LY T679, LG T679 LS T770, LO T770, LY T770, LG T770, LP T770 LB T773, LV T773, LT T773, LW T773 LH T774 LS E675, LA E675, LY E675, LS T675 LS T776, LA T776, LO T776, LY T776, LB T776 LHGB T686 LT T68C, LB T68C - Hyper Mini TOPLED® LB M676 - Mini TOPLED Santana® LG M470 LS M47K, LO M47K, LY M47K Source: http://www.osram.convergy.de LUXEON: - LUMILED® LXK2-PW12-R00, LXK2-PW12-S00, LXK2-PW14-U00, LXK2-PW14-V00 LXK2-PM12-R00, LXK2-PM12-S00, LXK2-PM14-U00 LXK2-PE12-Q00, LXK2-PE12-R00, LXK2-PE12-S00, LXK2-PE14-T00, LXK2-PE14-U00 LXK2-PB12-K00, LXK2-PB12-L00, LXK2-PB12-M00, LXK2-PB14-N00, LXK2-PB14-P00, LXK2-PB14-Q00 LXK2-PR12-L00, LXK2-PR12-M00, LXK2-PR14-Q00, LXK2-PR14-R00 LXK2-PD12-Q00, LXK2-PD12-R00, LXK2-PD12-S00 LXK2-PH12-R00, LXK2-PH12-S00 LXK2-PL12-P00, LXK2-PL12-Q00, LXK2-PL12-R00 Source: www.luxeon.com KINGBRIGHT: KA-3528ASYC Source: www.kingbright.com
CLOCK = pinhead:PINHD-1X1: PIN HEADER
IC1 = 74xx-eu:74*04: Hex INVERTER
IC2 IC3 = 74xx-eu:74*126: Quad bus BUFFER, 3-state
INPUT OUTPUT = pinhead:PINHD-1X8: PIN HEADER
LOWER_NIBBLE UPPER_NIBBLE = 74xx-us:74*173: 4-bit D type REGISTER, 3-state
POWER WRITE_READ = pinhead:PINHD-1X2: PIN HEADER
R1-R8 = resistor:R-EU_: RESISTOR, European symbol

## Module XOR
Ports: INPUT_A_1(in) INPUT_A_2(in) INPUT_A_3(in) INPUT_A_4(in) INPUT_A_5(in) INPUT_A_6(in) INPUT_A_7(in) INPUT_A_8(in) INPUT_B_1(in) INPUT_B_2(in) INPUT_B_3(in) INPUT_B_4(in) INPUT_B_5(in) INPUT_B_6(in) INPUT_B_7(in) INPUT_B_8(in) OUTPUT_1(out) OUTPUT_2(out) OUTPUT_3(out) OUTPUT_4(out) OUTPUT_5(out) OUTPUT_6(out) OUTPUT_7(out) OUTPUT_8(out) VCC(in) GND(in) ENABLE(in)
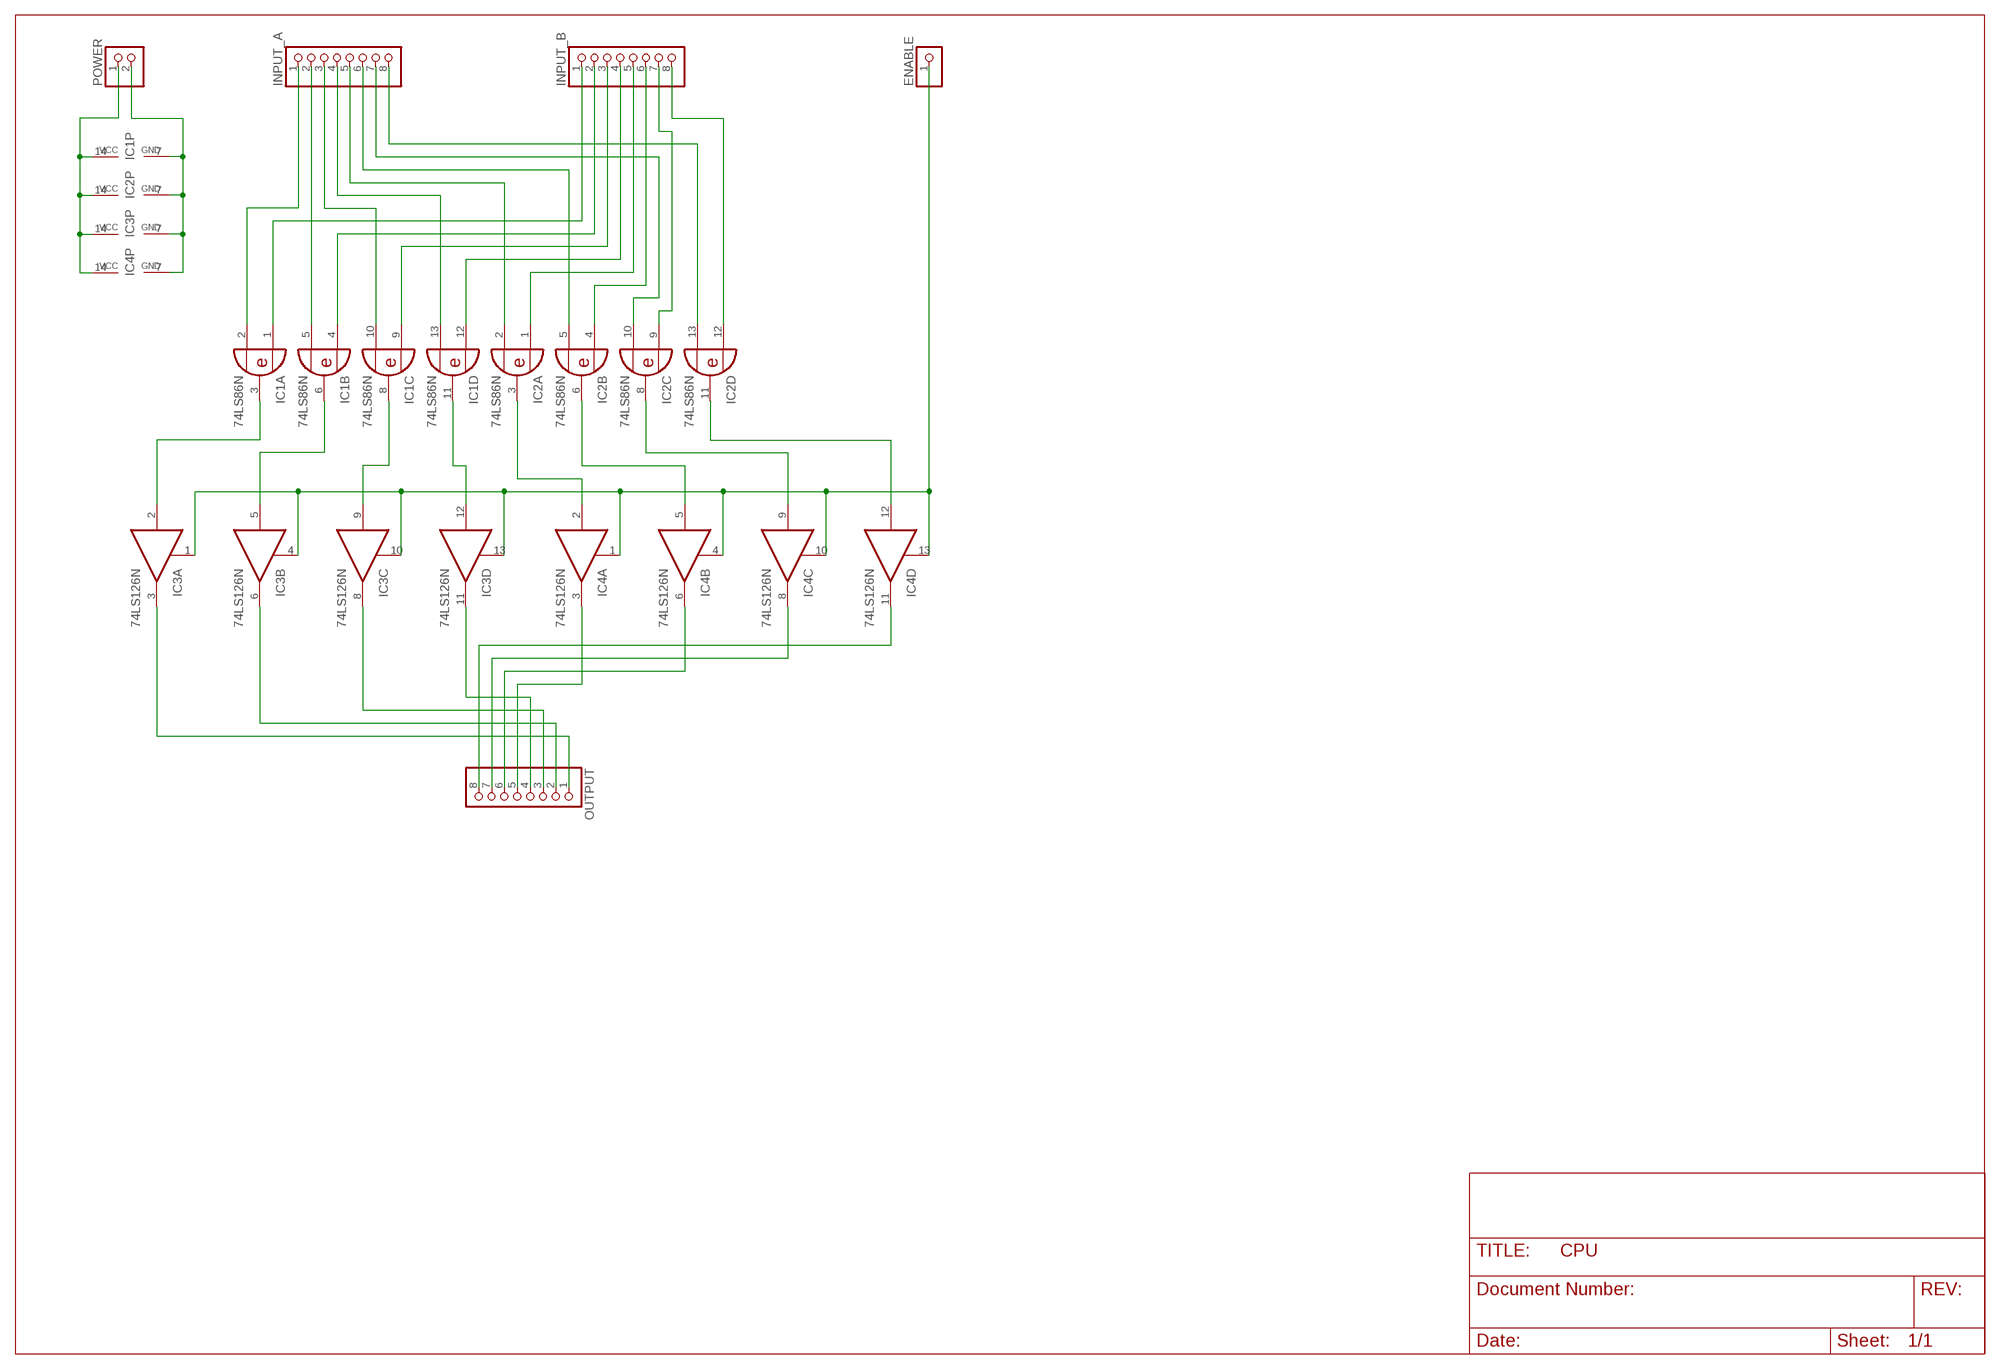
[diagram p6: schematic, module XOR, sheet 1]

### Parts
ENABLE  PINHD-1X1  [1X01]
IC1  74LS86N  [DIL14]
IC2  74LS86N  [DIL14]
IC3  74LS126N  [DIL14]
IC4  74LS126N  [DIL14]
INPUT_A  PINHD-1X8  [1X08]
INPUT_B  PINHD-1X8  [1X08]
OUTPUT  PINHD-1X8  [1X08]
POWER  PINHD-1X2  [1X02]

### Nets
ENABLE: ENABLE.1 IC3.1(A:OE) IC3.4(B:OE) IC3.10(C:OE) IC3.13(D:OE) IC4.1(A:OE) IC4.4(B:OE) IC4.10(C:OE) IC4.13(D:OE)
GND: IC1.7(P:GND) IC2.7(P:GND) IC3.7(P:GND) IC4.7(P:GND) POWER.2
INPUT_A_1: IC1.2(A:I1) INPUT_A.1
INPUT_A_2: IC1.5(B:I1) INPUT_A.2
INPUT_A_3: IC1.10(C:I1) INPUT_A.3
INPUT_A_4: IC1.13(D:I1) INPUT_A.4
INPUT_A_5: IC2.2(A:I1) INPUT_A.5
INPUT_A_6: IC2.5(B:I1) INPUT_A.6
INPUT_A_7: IC2.10(C:I1) INPUT_A.7
INPUT_A_8: IC2.13(D:I1) INPUT_A.8
INPUT_B_1: IC1.1(A:I0) INPUT_B.1
INPUT_B_2: IC1.4(B:I0) INPUT_B.2
INPUT_B_3: IC1.9(C:I0) INPUT_B.3
INPUT_B_4: IC1.12(D:I0) INPUT_B.4
INPUT_B_5: IC2.1(A:I0) INPUT_B.5
INPUT_B_6: IC2.4(B:I0) INPUT_B.6
INPUT_B_7: IC2.9(C:I0) INPUT_B.7
INPUT_B_8: IC2.12(D:I0) INPUT_B.8
N$17: IC1.3(A:O) IC3.2(A:I)
N$18: IC1.6(B:O) IC3.5(B:I)
N$19: IC1.8(C:O) IC3.9(C:I)
N$20: IC1.11(D:O) IC3.12(D:I)
N$21: IC2.3(A:O) IC4.2(A:I)
N$22: IC2.6(B:O) IC4.5(B:I)
N$23: IC2.8(C:O) IC4.9(C:I)
N$24: IC2.11(D:O) IC4.12(D:I)
OUTPUT_1: IC3.3(A:O) OUTPUT.1
OUTPUT_2: IC3.6(B:O) OUTPUT.2
OUTPUT_3: IC3.8(C:O) OUTPUT.3
OUTPUT_4: IC3.11(D:O) OUTPUT.4
OUTPUT_5: IC4.3(A:O) OUTPUT.5
OUTPUT_6: IC4.6(B:O) OUTPUT.6
OUTPUT_7: IC4.8(C:O) OUTPUT.7
OUTPUT_8: IC4.11(D:O) OUTPUT.8
VCC: IC1.14(P:VCC) IC2.14(P:VCC) IC3.14(P:VCC) IC4.14(P:VCC) POWER.1

### Library data of the parts
ENABLE = pinhead:PINHD-1X1: PIN HEADER
IC1 IC2 = 74xx-eu:74*86: Quad 2-input EXCLUSIVE-OR (XOR) gate
IC3 IC4 = 74xx-eu:74*126: Quad bus BUFFER, 3-state
INPUT_A INPUT_B OUTPUT = pinhead:PINHD-1X8: PIN HEADER
POWER = pinhead:PINHD-1X2: PIN HEADER

## Module AND
Ports: INPUT_A_1(in) INPUT_A_2(in) INPUT_A_3(in) INPUT_A_4(in) INPUT_A_5(in) INPUT_A_6(in) INPUT_A_7(in) INPUT_A_8(in) INPUT_B_1(in) INPUT_B_2(in) INPUT_B_3(in) INPUT_B_4(in) INPUT_B_5(in) INPUT_B_6(in) INPUT_B_7(in) INPUT_B_8(in) OUTPUT_1(out) OUTPUT_2(out) OUTPUT_3(out) OUTPUT_4(out) OUTPUT_5(out) OUTPUT_6(out) OUTPUT_7(out) OUTPUT_8(out) VCC(in) GND(in) ENABLE(in)
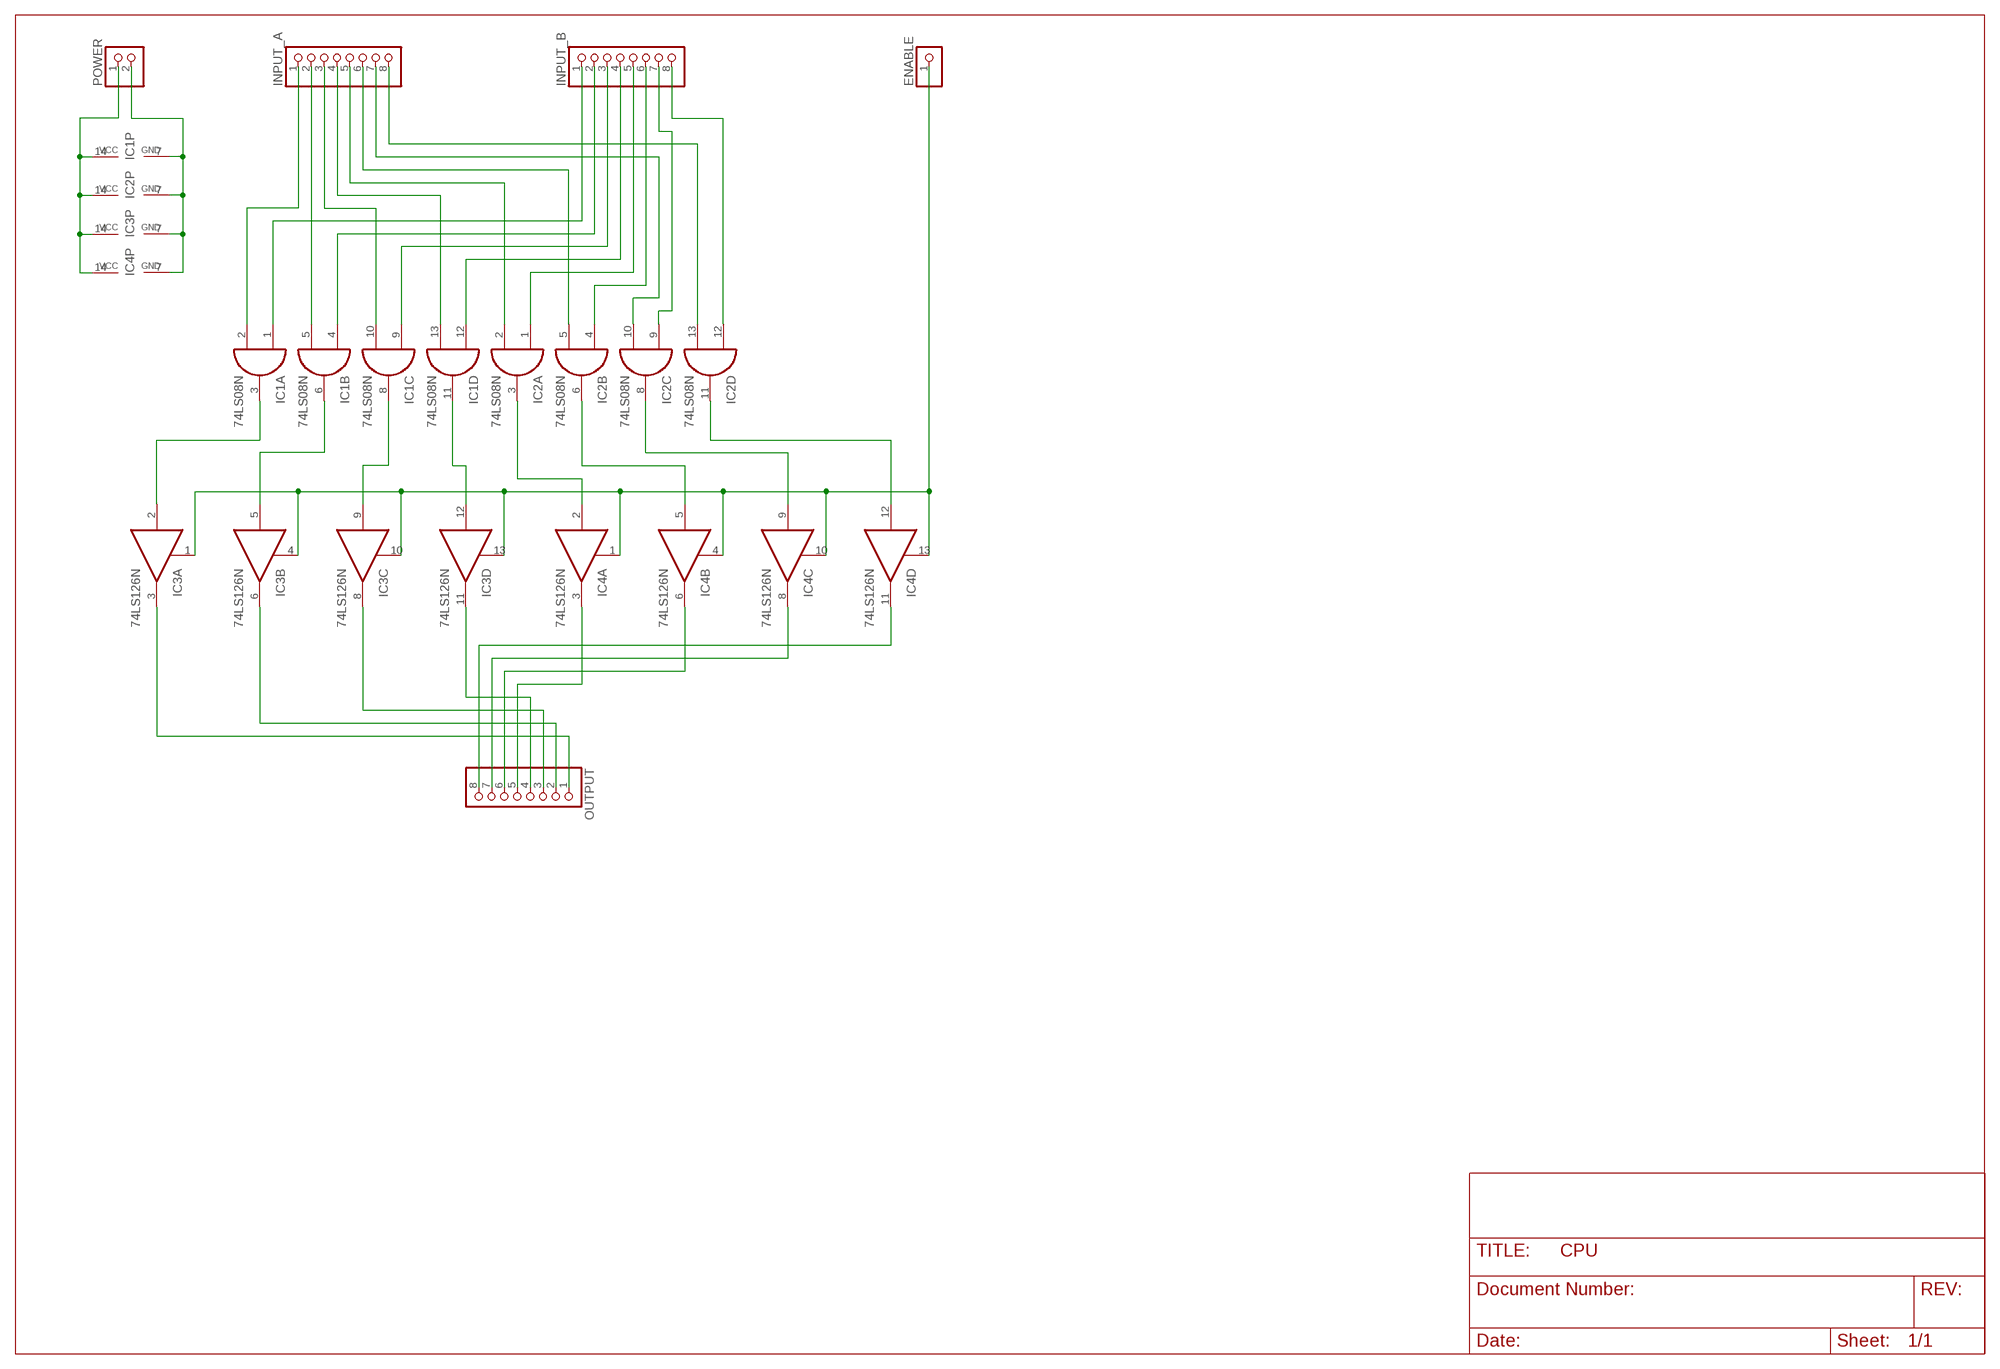
[diagram p7: schematic, module AND, sheet 1]

### Parts
ENABLE  PINHD-1X1  [1X01]
IC1  74LS08N  [DIL14]
IC2  74LS08N  [DIL14]
IC3  74LS126N  [DIL14]
IC4  74LS126N  [DIL14]
INPUT_A  PINHD-1X8  [1X08]
INPUT_B  PINHD-1X8  [1X08]
OUTPUT  PINHD-1X8  [1X08]
POWER  PINHD-1X2  [1X02]

### Nets
ENABLE: ENABLE.1 IC3.1(A:OE) IC3.4(B:OE) IC3.10(C:OE) IC3.13(D:OE) IC4.1(A:OE) IC4.4(B:OE) IC4.10(C:OE) IC4.13(D:OE)
GND: IC1.7(P:GND) IC2.7(P:GND) POWER.2
INPUT_A_1: IC1.2(A:I1) INPUT_A.1
INPUT_A_2: IC1.5(B:I1) INPUT_A.2
INPUT_A_3: IC1.10(C:I1) INPUT_A.3
INPUT_A_4: IC1.13(D:I1) INPUT_A.4
INPUT_A_5: IC2.2(A:I1) INPUT_A.5
INPUT_A_6: IC2.5(B:I1) INPUT_A.6
INPUT_A_7: IC2.10(C:I1) INPUT_A.7
INPUT_A_8: IC2.13(D:I1) INPUT_A.8
INPUT_B_1: IC1.1(A:I0) INPUT_B.1
INPUT_B_2: IC1.4(B:I0) INPUT_B.2
INPUT_B_3: IC1.9(C:I0) INPUT_B.3
INPUT_B_4: IC1.12(D:I0) INPUT_B.4
INPUT_B_5: IC2.1(A:I0) INPUT_B.5
INPUT_B_6: IC2.4(B:I0) INPUT_B.6
INPUT_B_7: IC2.9(C:I0) INPUT_B.7
INPUT_B_8: IC2.12(D:I0) INPUT_B.8
N$18: IC1.6(B:O) IC3.5(B:I)
N$19: IC1.8(C:O) IC3.9(C:I)
N$20: IC1.11(D:O) IC3.12(D:I)
N$21: IC2.3(A:O) IC4.2(A:I)
N$22: IC2.6(B:O) IC4.5(B:I)
N$23: IC2.8(C:O) IC4.9(C:I)
N$24: IC2.11(D:O) IC4.12(D:I)
N$34: IC1.3(A:O) IC3.2(A:I)
OUTPUT_1: IC3.3(A:O) OUTPUT.1
OUTPUT_2: IC3.6(B:O) OUTPUT.2
OUTPUT_3: IC3.8(C:O) OUTPUT.3
OUTPUT_4: IC3.11(D:O) OUTPUT.4
OUTPUT_5: IC4.3(A:O) OUTPUT.5
OUTPUT_6: IC4.6(B:O) OUTPUT.6
OUTPUT_7: IC4.8(C:O) OUTPUT.7
OUTPUT_8: IC4.11(D:O) OUTPUT.8
VCC: IC1.14(P:VCC) IC2.14(P:VCC) IC3.14(P:VCC) IC4.14(P:VCC) POWER.1

### Power pins joined to a net without a drawn wire
GND: IC3.7(P:GND) IC4.7(P:GND)

### Library data of the parts
ENABLE = pinhead:PINHD-1X1: PIN HEADER
IC1 IC2 = 74xx-eu:74*08: Quad 2-input AND gate
IC3 IC4 = 74xx-eu:74*126: Quad bus BUFFER, 3-state
INPUT_A INPUT_B OUTPUT = pinhead:PINHD-1X8: PIN HEADER
POWER = pinhead:PINHD-1X2: PIN HEADER

## Module FETCH_INCREMENT
Ports: T1(in) T2(in) T3(in) SRAM_READ(out) INCREMENTER(out) PC_WRITE(out) PC_READ(out) INC_WRITE(out) INC_READ(out) INSTRUCTION_WRITE(out) VCC(in) GND(in) T4(in) T5(in) T7(in) T8(in) T6(in)
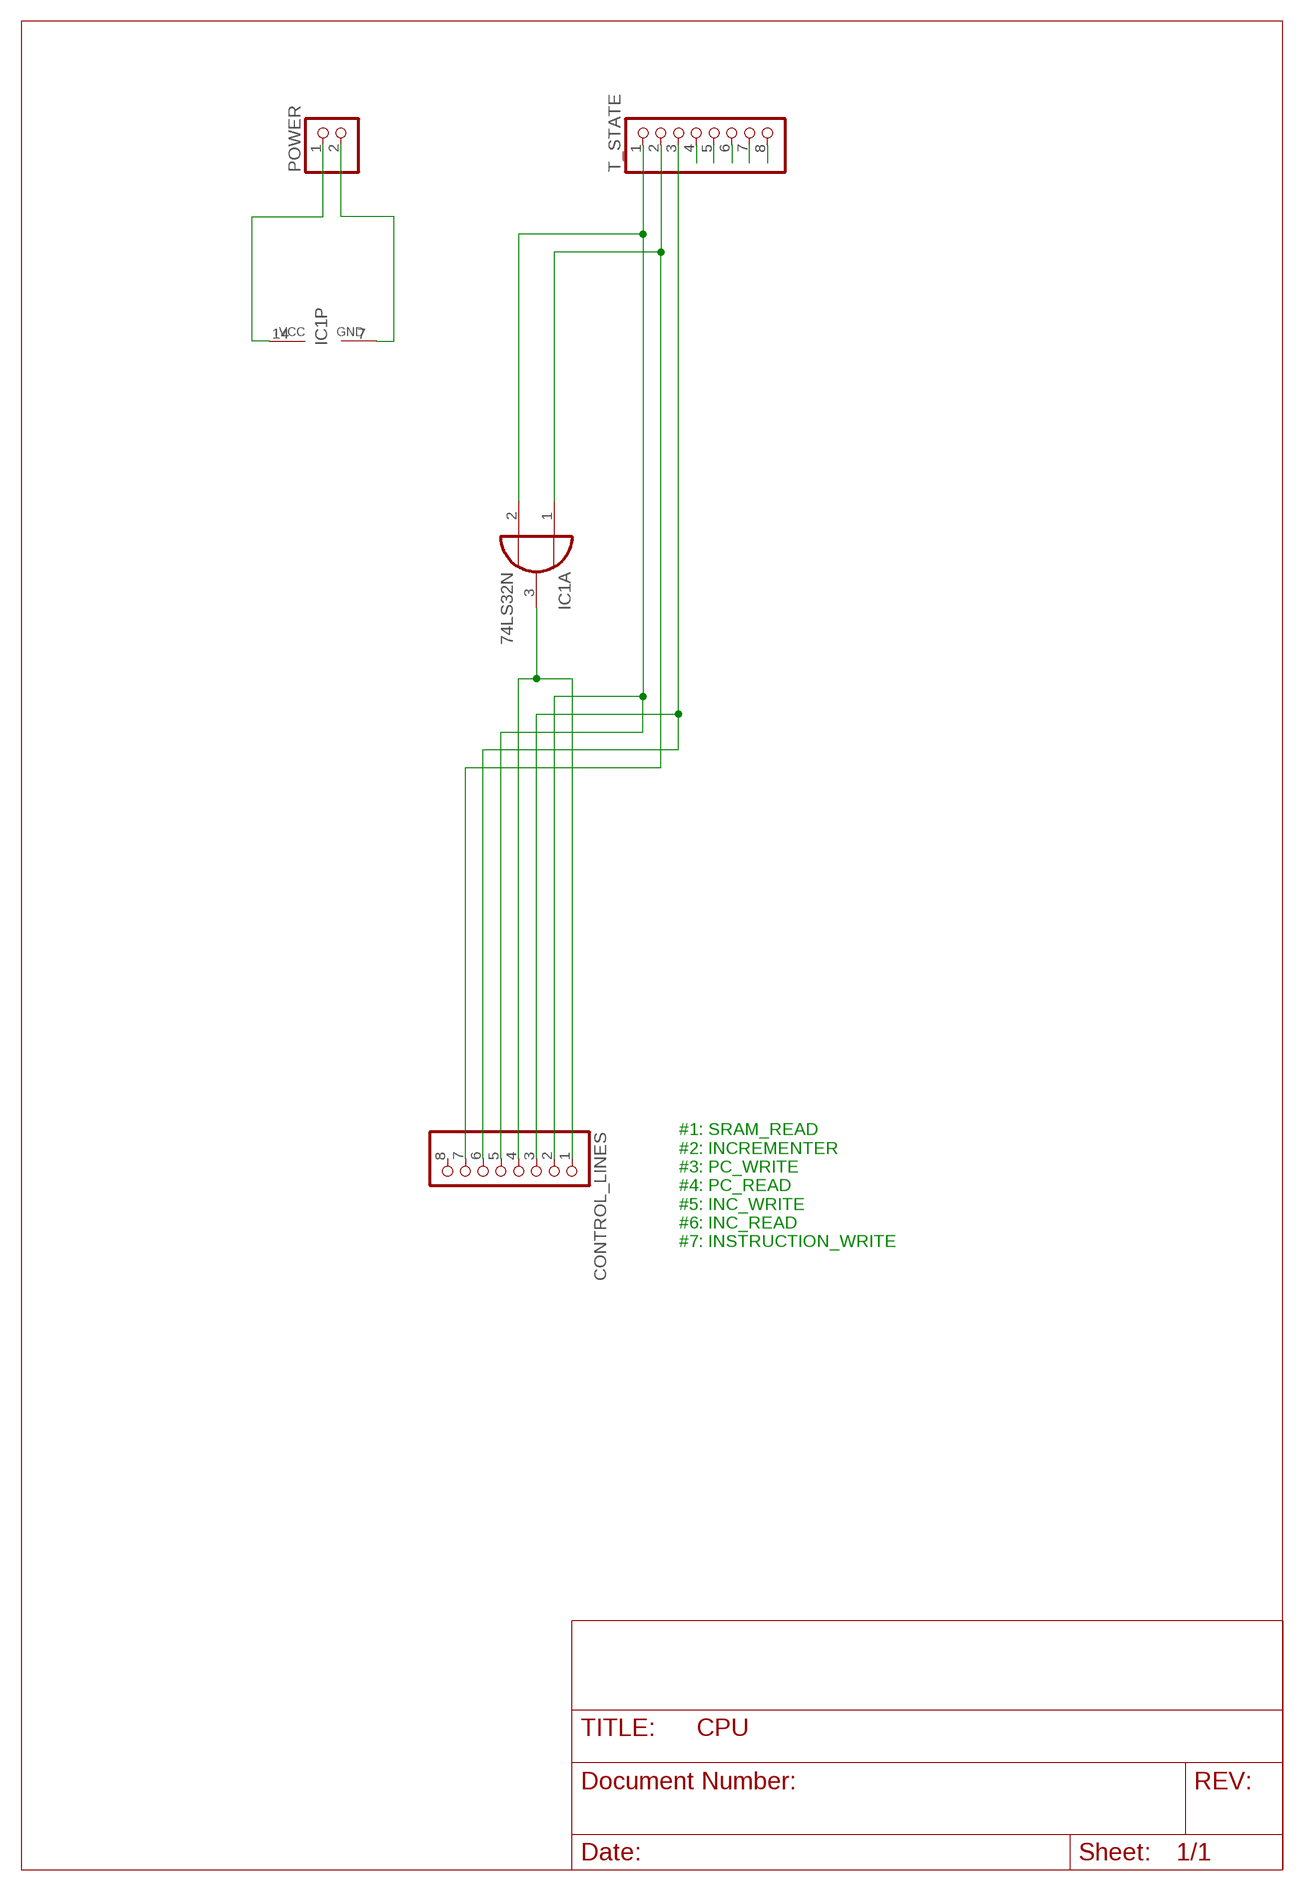
[diagram p8: schematic, module FETCH_INCREMENT, sheet 1]

### Parts
CONTROL_LINES  PINHD-1X8  [1X08]
IC1  74LS32N  [DIL14]
POWER  PINHD-1X2  [1X02]
T_STATE  PINHD-1X8  [1X08]

### Nets
GND: IC1.7(P:GND) POWER.2
INC_READ: CONTROL_LINES.3 CONTROL_LINES.6 T_STATE.3
INC_WRITE: CONTROL_LINES.2 CONTROL_LINES.5 IC1.2(A:I1) T_STATE.1
INSTRUCTION_WRITE: CONTROL_LINES.7 IC1.1(A:I0) T_STATE.2
PC_READ: CONTROL_LINES.1 CONTROL_LINES.4 IC1.3(A:O)
T4: T_STATE.4
T5: T_STATE.5
T6: T_STATE.6
T7: T_STATE.7
T8: T_STATE.8
VCC: IC1.14(P:VCC) POWER.1
Unconnected: CONTROL_LINES.8 IC1.4(B:I0) IC1.5(B:I1) IC1.6(B:O) IC1.8(C:O) IC1.9(C:I0) IC1.10(C:I1) IC1.11(D:O) IC1.12(D:I0) IC1.13(D:I1)

### Notes on the sheet
- #1: SRAM_READ
  #2: INCREMENTER
  #3: PC_WRITE
  #4: PC_READ
  #5: INC_WRITE
  #6: INC_READ
  #7: INSTRUCTION_WRITE

### Library data of the parts
CONTROL_LINES T_STATE = pinhead:PINHD-1X8: PIN HEADER
IC1 = 74xx-eu:74*32: Quad 2-input OR gate
POWER = pinhead:PINHD-1X2: PIN HEADER

## Module SETAB
Ports: T4(in) T5(in) T6(in) T7(in) I5(in) I6(in) I7(in) I8(in) SELECT_INSTRUCTION_TO_DATABUS(out) LOAD_INTERNAL_A_FROM_DATABUS(out) SELECT_INTERNAL_A_TO_DATABUS(out) LOAD_A_FROM_DATABUS(out) LOAD_B_FROM_DATABUS(out) VCC(in) GND(in) I4(in) I3(in) I2(in) I1(in) T8(in) T3(in) T2(in) T1(in)
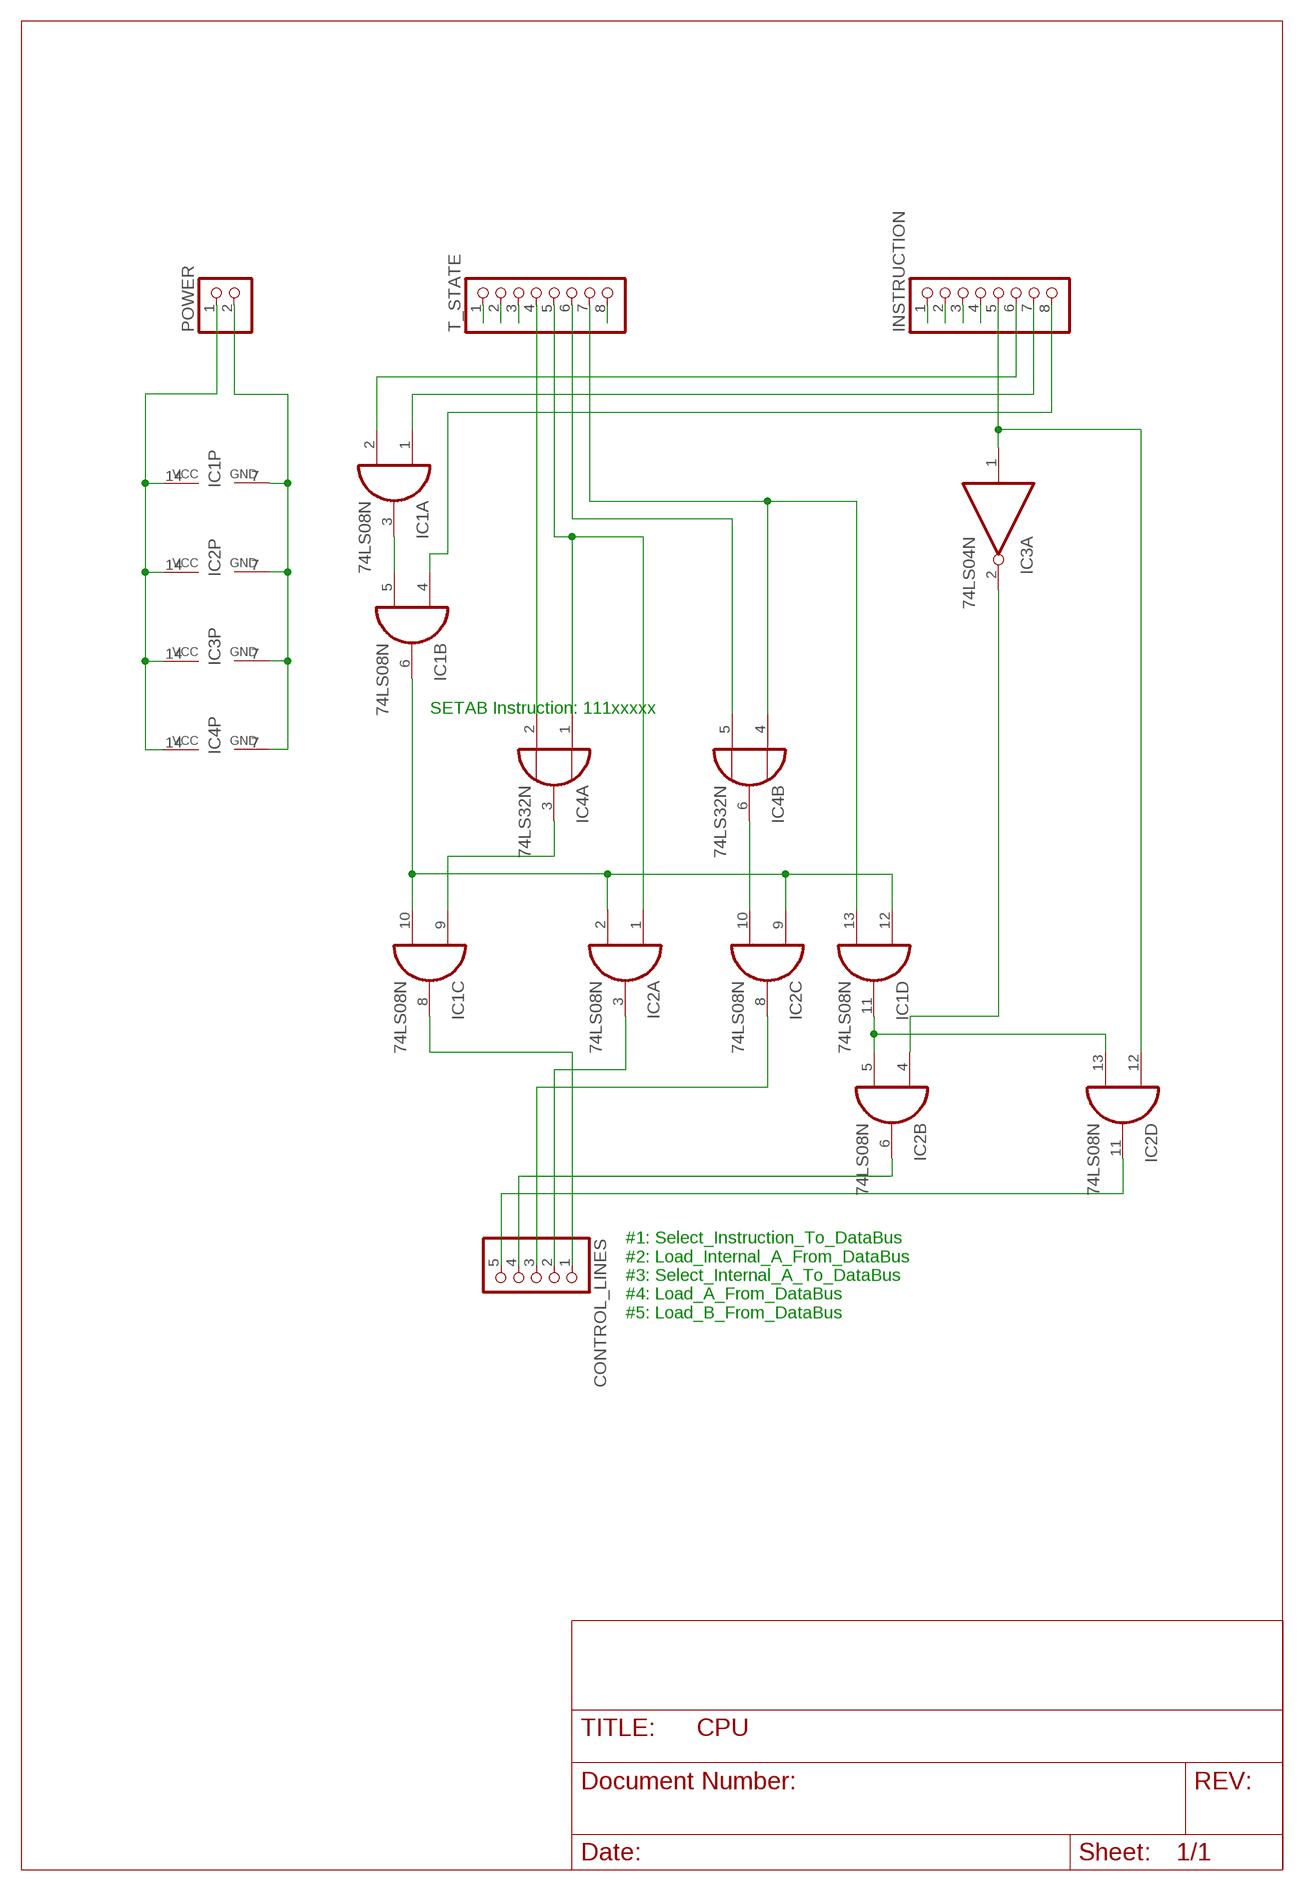
[diagram p9: schematic, module SETAB, sheet 1]

### Parts
CONTROL_LINES  PINHD-1X5  [1X05]
IC1  74LS08N  [DIL14]
IC2  74LS08N  [DIL14]
IC3  74LS04N  [DIL14]
IC4  74LS32N  [DIL14]
INSTRUCTION  PINHD-1X8  [1X08]
POWER  PINHD-1X2  [1X02]
T_STATE  PINHD-1X8  [1X08]

### Nets
GND: IC1.7(P:GND) IC2.7(P:GND) IC3.7(P:GND) IC4.7(P:GND) POWER.2
I1: INSTRUCTION.1
I2: INSTRUCTION.2
I3: INSTRUCTION.3
I4: INSTRUCTION.4
I5: IC2.12(D:I0) IC3.1(A:I) INSTRUCTION.5
I6: IC1.2(A:I1) INSTRUCTION.6
I7: IC1.1(A:I0) INSTRUCTION.7
I8: IC1.4(B:I0) INSTRUCTION.8
LOAD_A_FROM_DATABUS: CONTROL_LINES.4 IC2.6(B:O)
LOAD_B_FROM_DATABUS: CONTROL_LINES.5 IC2.11(D:O)
LOAD_INTERNAL_A_FROM_DATABUS: CONTROL_LINES.2 IC2.3(A:O)
N$3: IC1.3(A:O) IC1.5(B:I1)
N$8: IC1.6(B:O) IC1.10(C:I1) IC1.12(D:I0) IC2.2(A:I1) IC2.9(C:I0)
N$9: IC1.9(C:I0) IC4.3(A:O)
N$12: IC2.4(B:I0) IC3.2(A:O)
N$16: IC2.10(C:I1) IC4.6(B:O)
N$18: IC1.11(D:O) IC2.5(B:I1) IC2.13(D:I1)
SELECT_INSTRUCTION_TO_DATABUS: CONTROL_LINES.1 IC1.8(C:O)
SELECT_INTERNAL_A_TO_DATABUS: CONTROL_LINES.3 IC2.8(C:O)
T1: T_STATE.1
T2: T_STATE.2
T3: T_STATE.3
T4: IC4.2(A:I1) T_STATE.4
T5: IC2.1(A:I0) IC4.1(A:I0) T_STATE.5
T6: IC4.5(B:I1) T_STATE.6
T7: IC1.13(D:I1) IC4.4(B:I0) T_STATE.7
T8: T_STATE.8
VCC: IC1.14(P:VCC) IC2.14(P:VCC) IC3.14(P:VCC) IC4.14(P:VCC) POWER.1
Unconnected: IC3.3(B:I) IC3.4(B:O) IC3.5(C:I) IC3.6(C:O) IC3.8(D:O) IC3.9(D:I) IC3.10(E:O) IC3.11(E:I) IC3.12(F:O) IC3.13(F:I) IC4.8(C:O) IC4.9(C:I0) IC4.10(C:I1) IC4.11(D:O) IC4.12(D:I0) IC4.13(D:I1)

### Notes on the sheet
- SETAB Instruction: 111xxxxx
- #1: Select_Instruction_To_DataBus
  #2: Load_Internal_A_From_DataBus
  #3: Select_Internal_A_To_DataBus
  #4: Load_A_From_DataBus
  #5: Load_B_From_DataBus

### Library data of the parts
CONTROL_LINES = pinhead:PINHD-1X5: PIN HEADER
IC1 IC2 = 74xx-eu:74*08: Quad 2-input AND gate
IC3 = 74xx-eu:74*04: Hex INVERTER
IC4 = 74xx-eu:74*32: Quad 2-input OR gate
INSTRUCTION T_STATE = pinhead:PINHD-1X8: PIN HEADER
POWER = pinhead:PINHD-1X2: PIN HEADER

## Module HLT
Ports: I1(in) I2(in) I3(in) I4(in) I5(in) I6(in) I7(in) I8(in) STOP_CPU(out) VCC(in) GND(in)
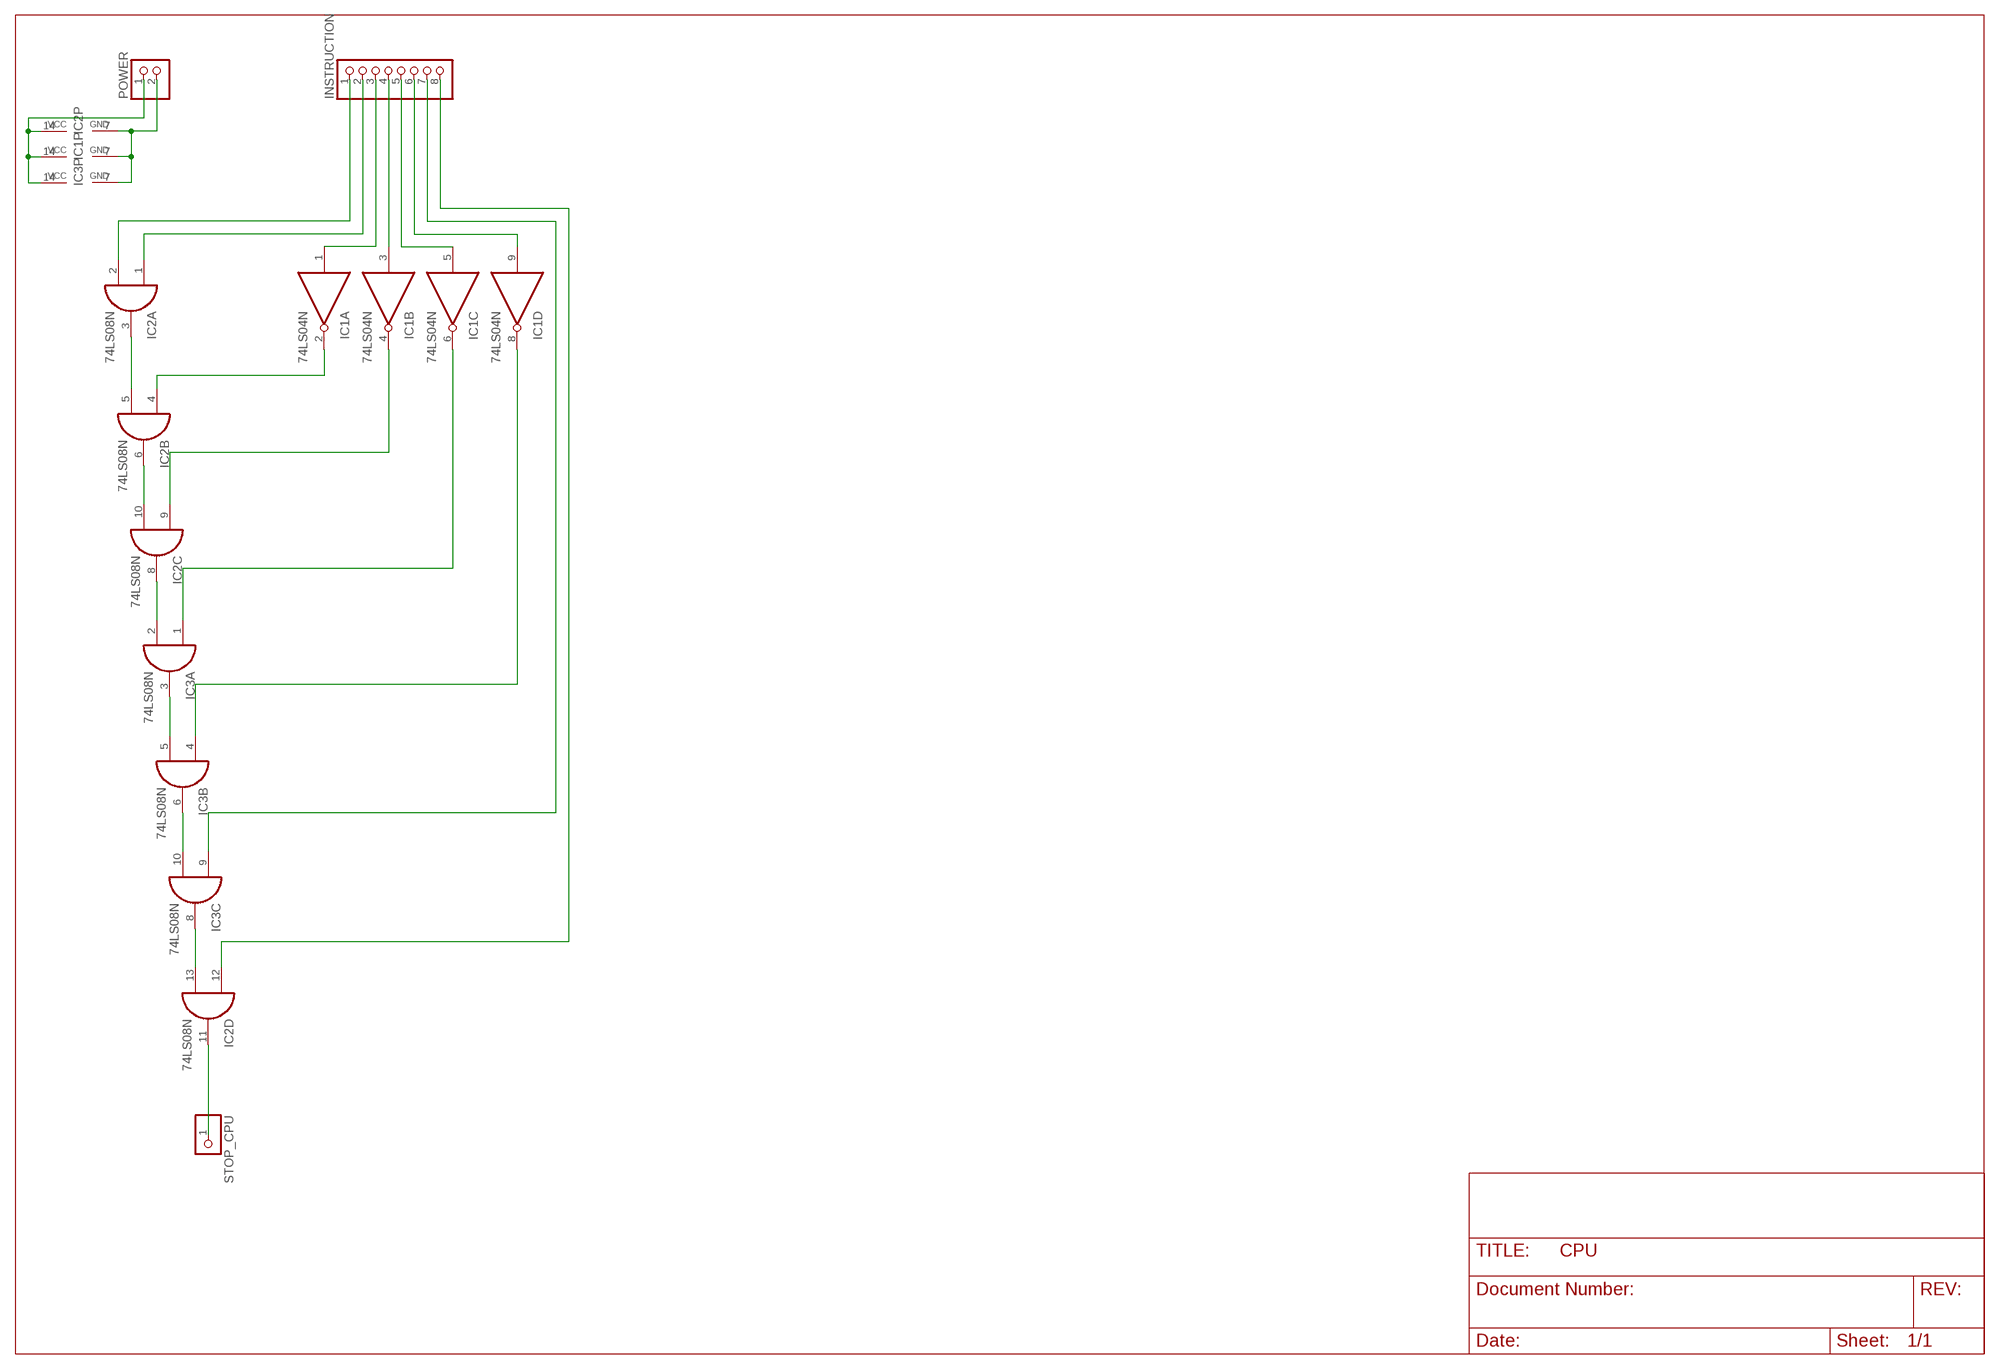
[diagram p10: schematic, module HLT, sheet 1]

### Parts
IC1  74LS04N  [DIL14]
IC2  74LS08N  [DIL14]
IC3  74LS08N  [DIL14]
INSTRUCTION  PINHD-1X8  [1X08]
POWER  PINHD-1X2  [1X02]
STOP_CPU  PINHD-1X1  [1X01]

### Nets
GND: IC1.7(P:GND) IC2.7(P:GND) IC3.7(P:GND) POWER.2
I1: IC2.2(A:I1) INSTRUCTION.1
I2: IC2.1(A:I0) INSTRUCTION.2
I3: IC1.1(A:I) INSTRUCTION.3
I4: IC1.3(B:I) INSTRUCTION.4
I5: IC1.5(C:I) INSTRUCTION.5
I6: IC1.9(D:I) INSTRUCTION.6
I7: IC3.9(C:I0) INSTRUCTION.7
I8: IC2.12(D:I0) INSTRUCTION.8
N$7: IC2.3(A:O) IC2.5(B:I1)
N$8: IC1.2(A:O) IC2.4(B:I0)
N$9: IC2.6(B:O) IC2.10(C:I1)
N$10: IC1.4(B:O) IC2.9(C:I0)
N$11: IC2.8(C:O) IC3.2(A:I1)
N$12: IC1.6(C:O) IC3.1(A:I0)
N$13: IC3.3(A:O) IC3.5(B:I1)
N$14: IC1.8(D:O) IC3.4(B:I0)
N$15: IC3.6(B:O) IC3.10(C:I1)
N$17: IC2.13(D:I1) IC3.8(C:O)
STOP_CPU: IC2.11(D:O) STOP_CPU.1
VCC: IC1.14(P:VCC) IC2.14(P:VCC) IC3.14(P:VCC) POWER.1
Unconnected: IC1.10(E:O) IC1.11(E:I) IC1.12(F:O) IC1.13(F:I) IC3.11(D:O) IC3.12(D:I0) IC3.13(D:I1)

### Library data of the parts
IC1 = 74xx-eu:74*04: Hex INVERTER
IC2 IC3 = 74xx-eu:74*08: Quad 2-input AND gate
INSTRUCTION = pinhead:PINHD-1X8: PIN HEADER
POWER = pinhead:PINHD-1X2: PIN HEADER
STOP_CPU = pinhead:PINHD-1X1: PIN HEADER

## Module REGISTER_16BIT
Ports: INPUT_1(in) INPUT_2(in) INPUT_3(in) INPUT_4(in) INPUT_5(in) INPUT_6(in) INPUT_7(in) INPUT_8(in) INPUT_9(in) INPUT_10(in) INPUT_11(in) INPUT_12(in) INPUT_13(in) INPUT_14(in) INPUT_15(in) INPUT_16(in) OUTPUT_1(out) OUTPUT_2(out) OUTPUT_3(out) OUTPUT_4(out) OUTPUT_5(out) OUTPUT_6(out) OUTPUT_7(out) OUTPUT_8(out) OUTPUT_9(out) OUTPUT_10(out) OUTPUT_11(out) OUTPUT_12(out) OUTPUT_13(out) OUTPUT_14(out) OUTPUT_15(out) OUTPUT_16(out) VCC(in) GND(in) CLOCK(in) WRITE(in) READ(in)
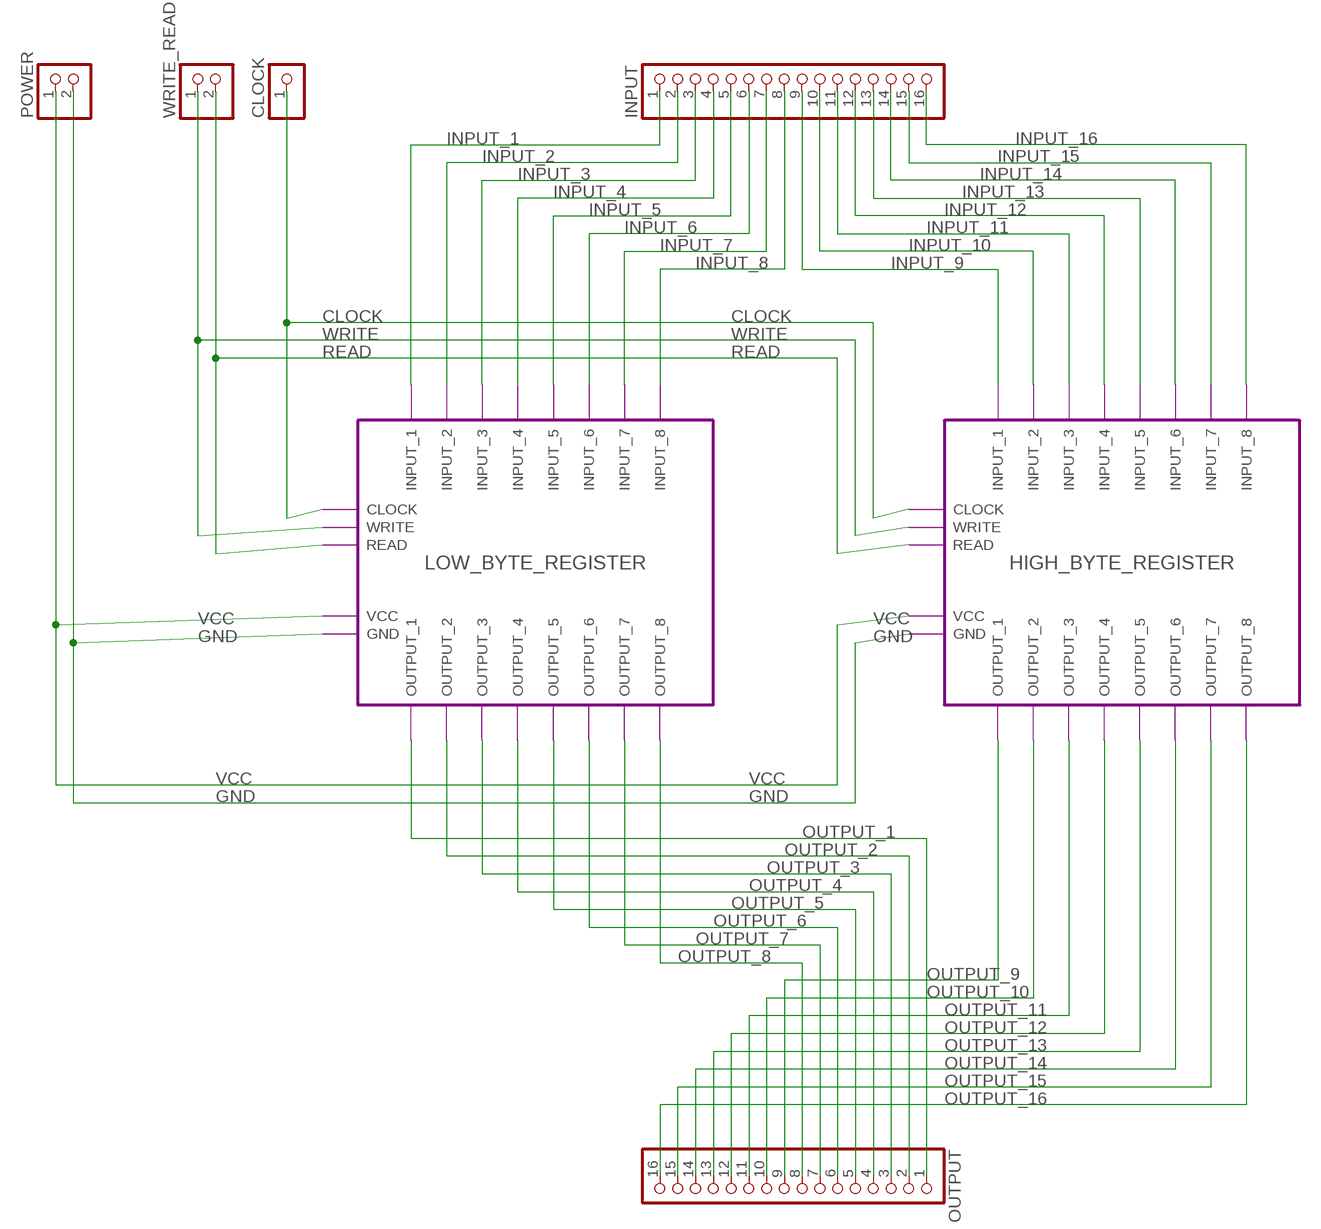
[diagram p11: schematic, module REGISTER_16BIT, sheet 1]

### Parts
CLOCK  PINHD-1X1  [1X01]
INPUT  PINHD-1X16  [1X16]
OUTPUT  PINHD-1X16  [1X16]
POWER  PINHD-1X2  [1X02]
WRITE_READ  PINHD-1X2  [1X02]

### Module instances
LOW_BYTE_REGISTER = REGISTER
HIGH_BYTE_REGISTER = REGISTER

### Nets
CLOCK: CLOCK.1 ; port LOW_BYTE_REGISTER.CLOCK HIGH_BYTE_REGISTER.CLOCK
GND: POWER.2 ; port LOW_BYTE_REGISTER.GND HIGH_BYTE_REGISTER.GND
INPUT_1: INPUT.1 ; port LOW_BYTE_REGISTER.INPUT_1
INPUT_2: INPUT.2 ; port LOW_BYTE_REGISTER.INPUT_2
INPUT_3: INPUT.3 ; port LOW_BYTE_REGISTER.INPUT_3
INPUT_4: INPUT.4 ; port LOW_BYTE_REGISTER.INPUT_4
INPUT_5: INPUT.5 ; port LOW_BYTE_REGISTER.INPUT_5
INPUT_6: INPUT.6 ; port LOW_BYTE_REGISTER.INPUT_6
INPUT_7: INPUT.7 ; port LOW_BYTE_REGISTER.INPUT_7
INPUT_8: INPUT.8 ; port LOW_BYTE_REGISTER.INPUT_8
INPUT_9: INPUT.9 ; port HIGH_BYTE_REGISTER.INPUT_1
INPUT_10: INPUT.10 ; port HIGH_BYTE_REGISTER.INPUT_2
INPUT_11: INPUT.11 ; port HIGH_BYTE_REGISTER.INPUT_3
INPUT_12: INPUT.12 ; port HIGH_BYTE_REGISTER.INPUT_4
INPUT_13: INPUT.13 ; port HIGH_BYTE_REGISTER.INPUT_5
INPUT_14: INPUT.14 ; port HIGH_BYTE_REGISTER.INPUT_6
INPUT_15: INPUT.15 ; port HIGH_BYTE_REGISTER.INPUT_7
INPUT_16: INPUT.16 ; port HIGH_BYTE_REGISTER.INPUT_8
OUTPUT_1: OUTPUT.1 ; port LOW_BYTE_REGISTER.OUTPUT_1
OUTPUT_2: OUTPUT.2 ; port LOW_BYTE_REGISTER.OUTPUT_2
OUTPUT_3: OUTPUT.3 ; port LOW_BYTE_REGISTER.OUTPUT_3
OUTPUT_4: OUTPUT.4 ; port LOW_BYTE_REGISTER.OUTPUT_4
OUTPUT_5: OUTPUT.5 ; port LOW_BYTE_REGISTER.OUTPUT_5
OUTPUT_6: OUTPUT.6 ; port LOW_BYTE_REGISTER.OUTPUT_6
OUTPUT_7: OUTPUT.7 ; port LOW_BYTE_REGISTER.OUTPUT_7
OUTPUT_8: OUTPUT.8 ; port LOW_BYTE_REGISTER.OUTPUT_8
OUTPUT_9: OUTPUT.9 ; port HIGH_BYTE_REGISTER.OUTPUT_1
OUTPUT_10: OUTPUT.10 ; port HIGH_BYTE_REGISTER.OUTPUT_2
OUTPUT_11: OUTPUT.11 ; port HIGH_BYTE_REGISTER.OUTPUT_3
OUTPUT_12: OUTPUT.12 ; port HIGH_BYTE_REGISTER.OUTPUT_4
OUTPUT_13: OUTPUT.13 ; port HIGH_BYTE_REGISTER.OUTPUT_5
OUTPUT_14: OUTPUT.14 ; port HIGH_BYTE_REGISTER.OUTPUT_6
OUTPUT_15: OUTPUT.15 ; port HIGH_BYTE_REGISTER.OUTPUT_7
OUTPUT_16: OUTPUT.16 ; port HIGH_BYTE_REGISTER.OUTPUT_8
READ: WRITE_READ.2 ; port LOW_BYTE_REGISTER.READ HIGH_BYTE_REGISTER.READ
VCC: POWER.1 ; port LOW_BYTE_REGISTER.VCC HIGH_BYTE_REGISTER.VCC
WRITE: WRITE_READ.1 ; port LOW_BYTE_REGISTER.WRITE HIGH_BYTE_REGISTER.WRITE

### Library data of the parts
CLOCK = pinhead:PINHD-1X1: PIN HEADER
INPUT OUTPUT = pinhead:PINHD-1X16: PIN HEADER
POWER WRITE_READ = pinhead:PINHD-1X2: PIN HEADER

## Module 2-1-SELECTOR
Ports: INPUT_SELECTOR(in) INPUT_A_1(in) INPUT_A_2(in) INPUT_A_3(in) INPUT_A_4(in) INPUT_A_5(in) INPUT_A_6(in) INPUT_A_7(in) INPUT_A_8(in) INPUT_B_1(in) INPUT_B_2(in) INPUT_B_3(in) INPUT_B_4(in) INPUT_B_5(in) INPUT_B_6(in) INPUT_B_7(in) INPUT_B_8(in) OUTPUT_1(out) OUTPUT_2(out) OUTPUT_3(out) OUTPUT_4(out) OUTPUT_5(out) OUTPUT_6(out) OUTPUT_7(out) OUTPUT_8(out) VCC(in) GND(in)
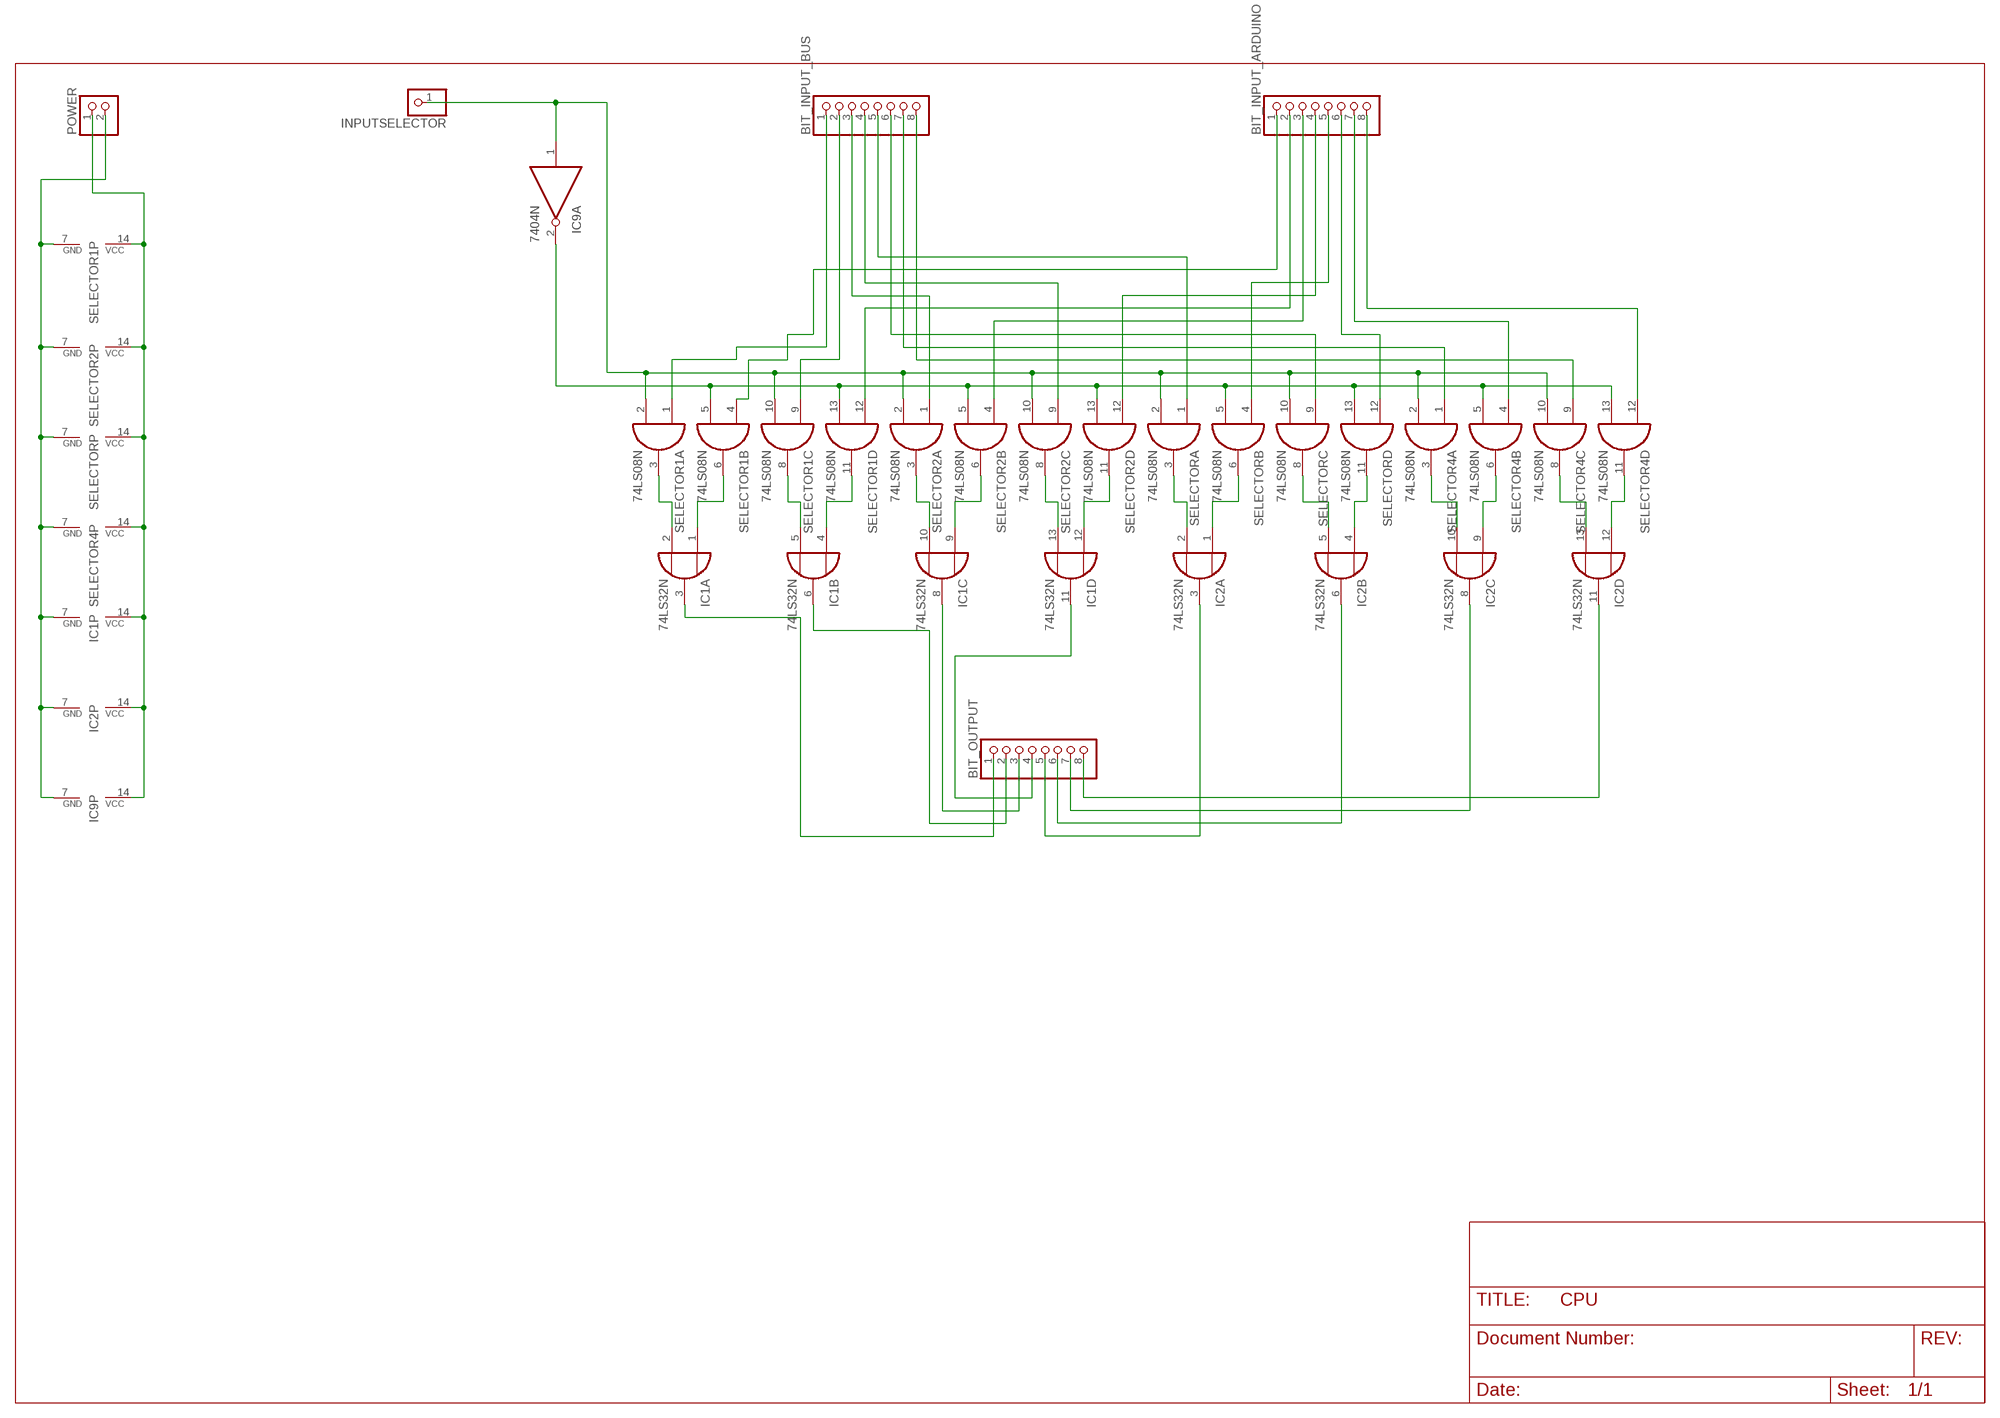
[diagram p12: schematic, module 2-1-SELECTOR, sheet 1]

### Parts
BIT_INPUT_ARDUINO  PINHD-1X8  [1X08]
BIT_INPUT_BUS  PINHD-1X8  [1X08]
BIT_OUTPUT  PINHD-1X8  [1X08]
IC1  74LS32N  [DIL14]
IC2  74LS32N  [DIL14]
IC9  7404N  [DIL14]
INPUTSELECTOR  PINHD-1X1  [1X01]
POWER  PINHD-1X2  [1X02]
SELECTOR  74LS08N  [DIL14]
SELECTOR1  74LS08N  [DIL14]
SELECTOR2  74LS08N  [DIL14]
SELECTOR4  74LS08N  [DIL14]

### Nets
GND: IC1.7(P:GND) IC2.7(P:GND) IC9.7(P:GND) POWER.2 SELECTOR1.7(P:GND) SELECTOR2.7(P:GND) SELECTOR4.7(P:GND) SELECTOR.7(P:GND)
INPUT_A_1: BIT_INPUT_BUS.1 SELECTOR1.1(A:I0)
INPUT_A_2: BIT_INPUT_BUS.2 SELECTOR1.9(C:I0)
INPUT_A_3: BIT_INPUT_BUS.3 SELECTOR2.1(A:I0)
INPUT_A_4: BIT_INPUT_BUS.4 SELECTOR2.9(C:I0)
INPUT_A_5: BIT_INPUT_BUS.5 SELECTOR.1(A:I0)
INPUT_A_6: BIT_INPUT_BUS.6 SELECTOR.9(C:I0)
INPUT_A_7: BIT_INPUT_BUS.7 SELECTOR4.1(A:I0)
INPUT_A_8: BIT_INPUT_BUS.8 SELECTOR4.9(C:I0)
INPUT_B_1: BIT_INPUT_ARDUINO.1 SELECTOR1.4(B:I0)
INPUT_B_2: BIT_INPUT_ARDUINO.2 SELECTOR1.12(D:I0)
INPUT_B_3: BIT_INPUT_ARDUINO.3 SELECTOR2.4(B:I0)
INPUT_B_4: BIT_INPUT_ARDUINO.4 SELECTOR2.12(D:I0)
INPUT_B_5: BIT_INPUT_ARDUINO.5 SELECTOR.4(B:I0)
INPUT_B_6: BIT_INPUT_ARDUINO.6 SELECTOR.12(D:I0)
INPUT_B_7: BIT_INPUT_ARDUINO.7 SELECTOR4.4(B:I0)
INPUT_B_8: BIT_INPUT_ARDUINO.8 SELECTOR4.12(D:I0)
INPUT_SELECTOR: IC9.1(A:I) INPUTSELECTOR.1 SELECTOR1.2(A:I1) SELECTOR1.10(C:I1) SELECTOR2.2(A:I1) SELECTOR2.10(C:I1) SELECTOR4.2(A:I1) SELECTOR4.10(C:I1) SELECTOR.2(A:I1) SELECTOR.10(C:I1)
N$5: IC9.2(A:O) SELECTOR1.5(B:I1) SELECTOR1.13(D:I1) SELECTOR2.5(B:I1) SELECTOR2.13(D:I1) SELECTOR4.5(B:I1) SELECTOR4.13(D:I1) SELECTOR.5(B:I1) SELECTOR.13(D:I1)
N$39: IC1.2(A:I1) SELECTOR1.3(A:O)
N$40: IC1.1(A:I0) SELECTOR1.6(B:O)
N$41: IC1.5(B:I1) SELECTOR1.8(C:O)
N$42: IC1.4(B:I0) SELECTOR1.11(D:O)
N$43: IC1.10(C:I1) SELECTOR2.3(A:O)
N$44: IC1.9(C:I0) SELECTOR2.6(B:O)
N$45: IC1.13(D:I1) SELECTOR2.8(C:O)
N$46: IC1.12(D:I0) SELECTOR2.11(D:O)
N$47: IC2.2(A:I1) SELECTOR.3(A:O)
N$48: IC2.1(A:I0) SELECTOR.6(B:O)
N$49: IC2.5(B:I1) SELECTOR.8(C:O)
N$50: IC2.4(B:I0) SELECTOR.11(D:O)
N$51: IC2.10(C:I1) SELECTOR4.3(A:O)
N$52: IC2.9(C:I0) SELECTOR4.6(B:O)
N$53: IC2.13(D:I1) SELECTOR4.8(C:O)
N$54: IC2.12(D:I0) SELECTOR4.11(D:O)
OUTPUT_1: BIT_OUTPUT.1 IC1.3(A:O)
OUTPUT_2: BIT_OUTPUT.2 IC1.6(B:O)
OUTPUT_3: BIT_OUTPUT.3 IC1.8(C:O)
OUTPUT_4: BIT_OUTPUT.4 IC1.11(D:O)
OUTPUT_5: BIT_OUTPUT.5 IC2.3(A:O)
OUTPUT_6: BIT_OUTPUT.6 IC2.6(B:O)
OUTPUT_7: BIT_OUTPUT.7 IC2.8(C:O)
OUTPUT_8: BIT_OUTPUT.8 IC2.11(D:O)
VCC: IC1.14(P:VCC) IC2.14(P:VCC) IC9.14(P:VCC) POWER.1 SELECTOR1.14(P:VCC) SELECTOR2.14(P:VCC) SELECTOR4.14(P:VCC) SELECTOR.14(P:VCC)
Unconnected: IC9.3(B:I) IC9.4(B:O) IC9.5(C:I) IC9.6(C:O) IC9.8(D:O) IC9.9(D:I) IC9.10(E:O) IC9.11(E:I) IC9.12(F:O) IC9.13(F:I)

### Library data of the parts
BIT_INPUT_ARDUINO BIT_INPUT_BUS BIT_OUTPUT = pinhead:PINHD-1X8: PIN HEADER
IC1 IC2 = 74xx-eu:74*32: Quad 2-input OR gate
IC9 = 74xx-eu:74*04: Hex INVERTER
INPUTSELECTOR = pinhead:PINHD-1X1: PIN HEADER
POWER = pinhead:PINHD-1X2: PIN HEADER
SELECTOR SELECTOR1 SELECTOR2 SELECTOR4 = 74xx-eu:74*08: Quad 2-input AND gate

## Module BUS_ENABLE
Ports: INPUT_1(in) INPUT_2(in) INPUT_3(in) INPUT_4(in) INPUT_5(in) INPUT_6(in) INPUT_7(in) INPUT_8(in) OUTPUT_1(out) OUTPUT_2(out) OUTPUT_3(out) OUTPUT_4(out) OUTPUT_5(out) OUTPUT_6(out) OUTPUT_7(out) OUTPUT_8(out) ENABLE(in) VCC(in) GND(in)
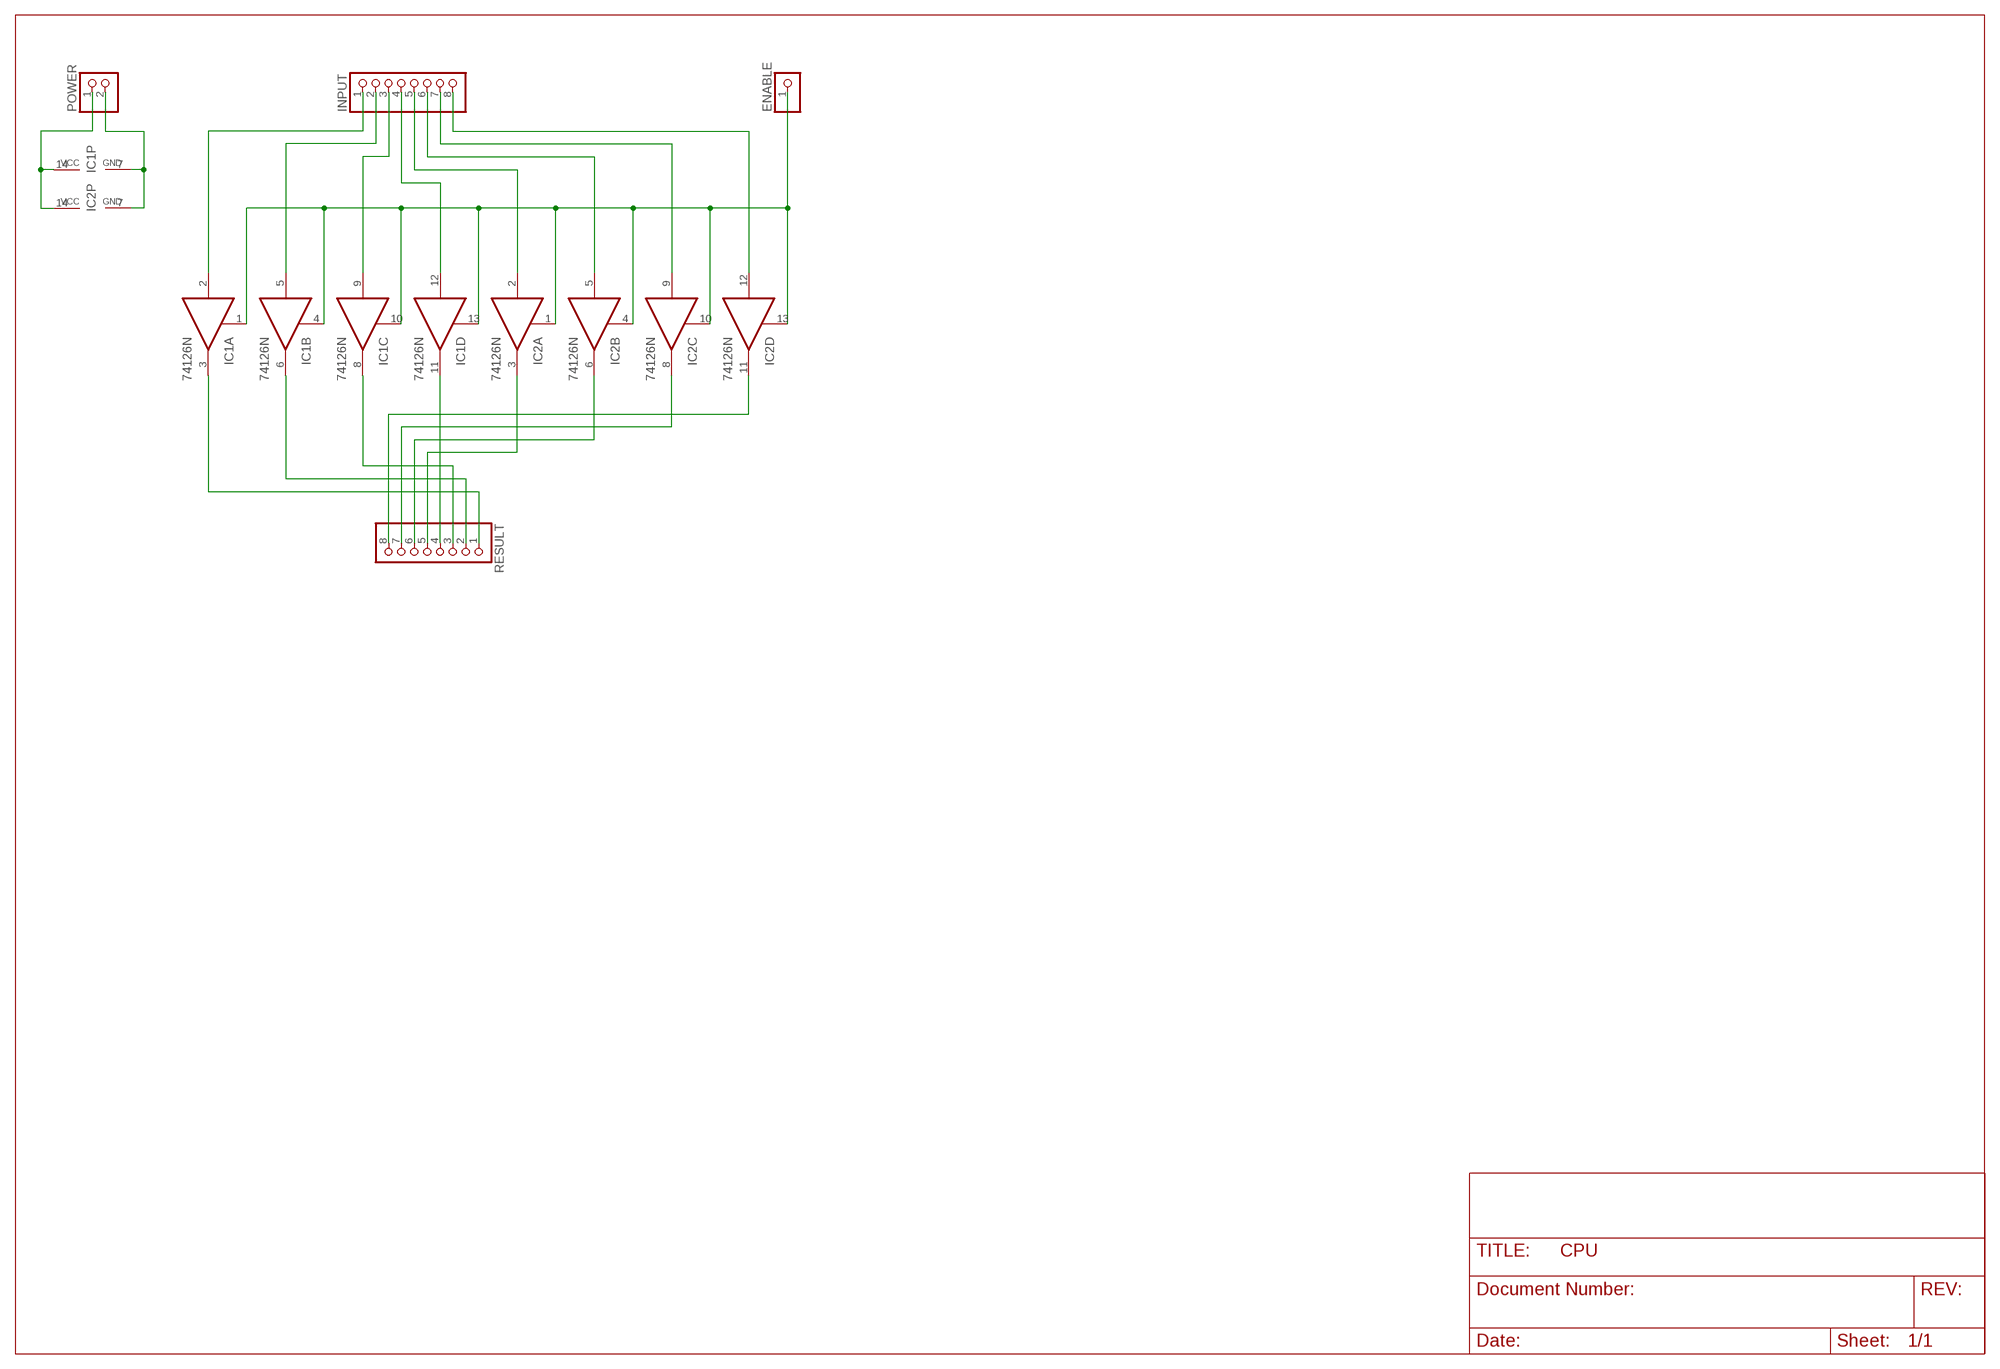
[diagram p13: schematic, module BUS_ENABLE, sheet 1]

### Parts
ENABLE  PINHD-1X1  [1X01]
IC1  74126N  [DIL14]
IC2  74126N  [DIL14]
INPUT  PINHD-1X8  [1X08]
POWER  PINHD-1X2  [1X02]
RESULT  PINHD-1X8  [1X08]

### Nets
ENABLE: ENABLE.1 IC1.1(A:OE) IC1.4(B:OE) IC1.10(C:OE) IC1.13(D:OE) IC2.1(A:OE) IC2.4(B:OE) IC2.10(C:OE) IC2.13(D:OE)
GND: IC1.7(P:GND) IC2.7(P:GND) POWER.2
INPUT_1: IC1.2(A:I) INPUT.1
INPUT_2: IC1.5(B:I) INPUT.2
INPUT_3: IC1.9(C:I) INPUT.3
INPUT_4: IC1.12(D:I) INPUT.4
INPUT_5: IC2.2(A:I) INPUT.5
INPUT_6: IC2.5(B:I) INPUT.6
INPUT_7: IC2.9(C:I) INPUT.7
INPUT_8: IC2.12(D:I) INPUT.8
OUTPUT_1: IC1.3(A:O) RESULT.1
OUTPUT_2: IC1.6(B:O) RESULT.2
OUTPUT_3: IC1.8(C:O) RESULT.3
OUTPUT_4: IC1.11(D:O) RESULT.4
OUTPUT_5: IC2.3(A:O) RESULT.5
OUTPUT_6: IC2.6(B:O) RESULT.6
OUTPUT_7: IC2.8(C:O) RESULT.7
OUTPUT_8: IC2.11(D:O) RESULT.8
VCC: IC1.14(P:VCC) IC2.14(P:VCC) POWER.1

### Library data of the parts
ENABLE = pinhead:PINHD-1X1: PIN HEADER
IC1 IC2 = 74xx-eu:74*126: Quad bus BUFFER, 3-state
INPUT RESULT = pinhead:PINHD-1X8: PIN HEADER
POWER = pinhead:PINHD-1X2: PIN HEADER

## Module EXTENDED_REGISTER_16BIT
Ports: ADDRESSBUS_INPUT_1(in) ADDRESSBUS_INPUT_2(in) ADDRESSBUS_INPUT_3(in) ADDRESSBUS_INPUT_4(in) ADDRESSBUS_INPUT_5(in) ADDRESSBUS_INPUT_6(in) ADDRESSBUS_INPUT_7(in) ADDRESSBUS_INPUT_8(in) ADDRESSBUS_INPUT_9(in) ADDRESSBUS_INPUT_10(in) ADDRESSBUS_INPUT_11(in) ADDRESSBUS_INPUT_12(in) ADDRESSBUS_INPUT_13(in) ADDRESSBUS_INPUT_14(in) ADDRESSBUS_INPUT_15(in) ADDRESSBUS_INPUT_16(in) ADDRESSBUS_OUTPUT_1(out) ADDRESSBUS_OUTPUT_2(out) ADDRESSBUS_OUTPUT_3(out) ADDRESSBUS_OUTPUT_4(out) ADDRESSBUS_OUTPUT_5(out) ADDRESSBUS_OUTPUT_6(out) ADDRESSBUS_OUTPUT_7(out) ADDRESSBUS_OUTPUT_8(out) ADDRESSBUS_OUTPUT_9(out) ADDRESSBUS_OUTPUT_10(out) ADDRESSBUS_OUTPUT_11(out) ADDRESSBUS_OUTPUT_12(out) ADDRESSBUS_OUTPUT_13(out) ADDRESSBUS_OUTPUT_14(out) ADDRESSBUS_OUTPUT_15(out) ADDRESSBUS_OUTPUT_16(out) DATABUS_INPUT_1(in) DATABUS_INPUT_2(in) DATABUS_INPUT_3(in) DATABUS_INPUT_4(in) DATABUS_INPUT_5(in) DATABUS_INPUT_6(in) DATABUS_INPUT_7(in) DATABUS_INPUT_8(in) DATABUS_OUTPUT_1(out) DATABUS_OUTPUT_2(out) DATABUS_OUTPUT_3(out) DATABUS_OUTPUT_4(out) DATABUS_OUTPUT_5(out) DATABUS_OUTPUT_6(out) DATABUS_OUTPUT_7(out) DATABUS_OUTPUT_8(out) CLOCK(in) GND(in) VCC(in) XH_READ(in) XH_WRITE(in) XL_READ(in) XL_WRITE(in) X_READ(in) X_WRITE(in)
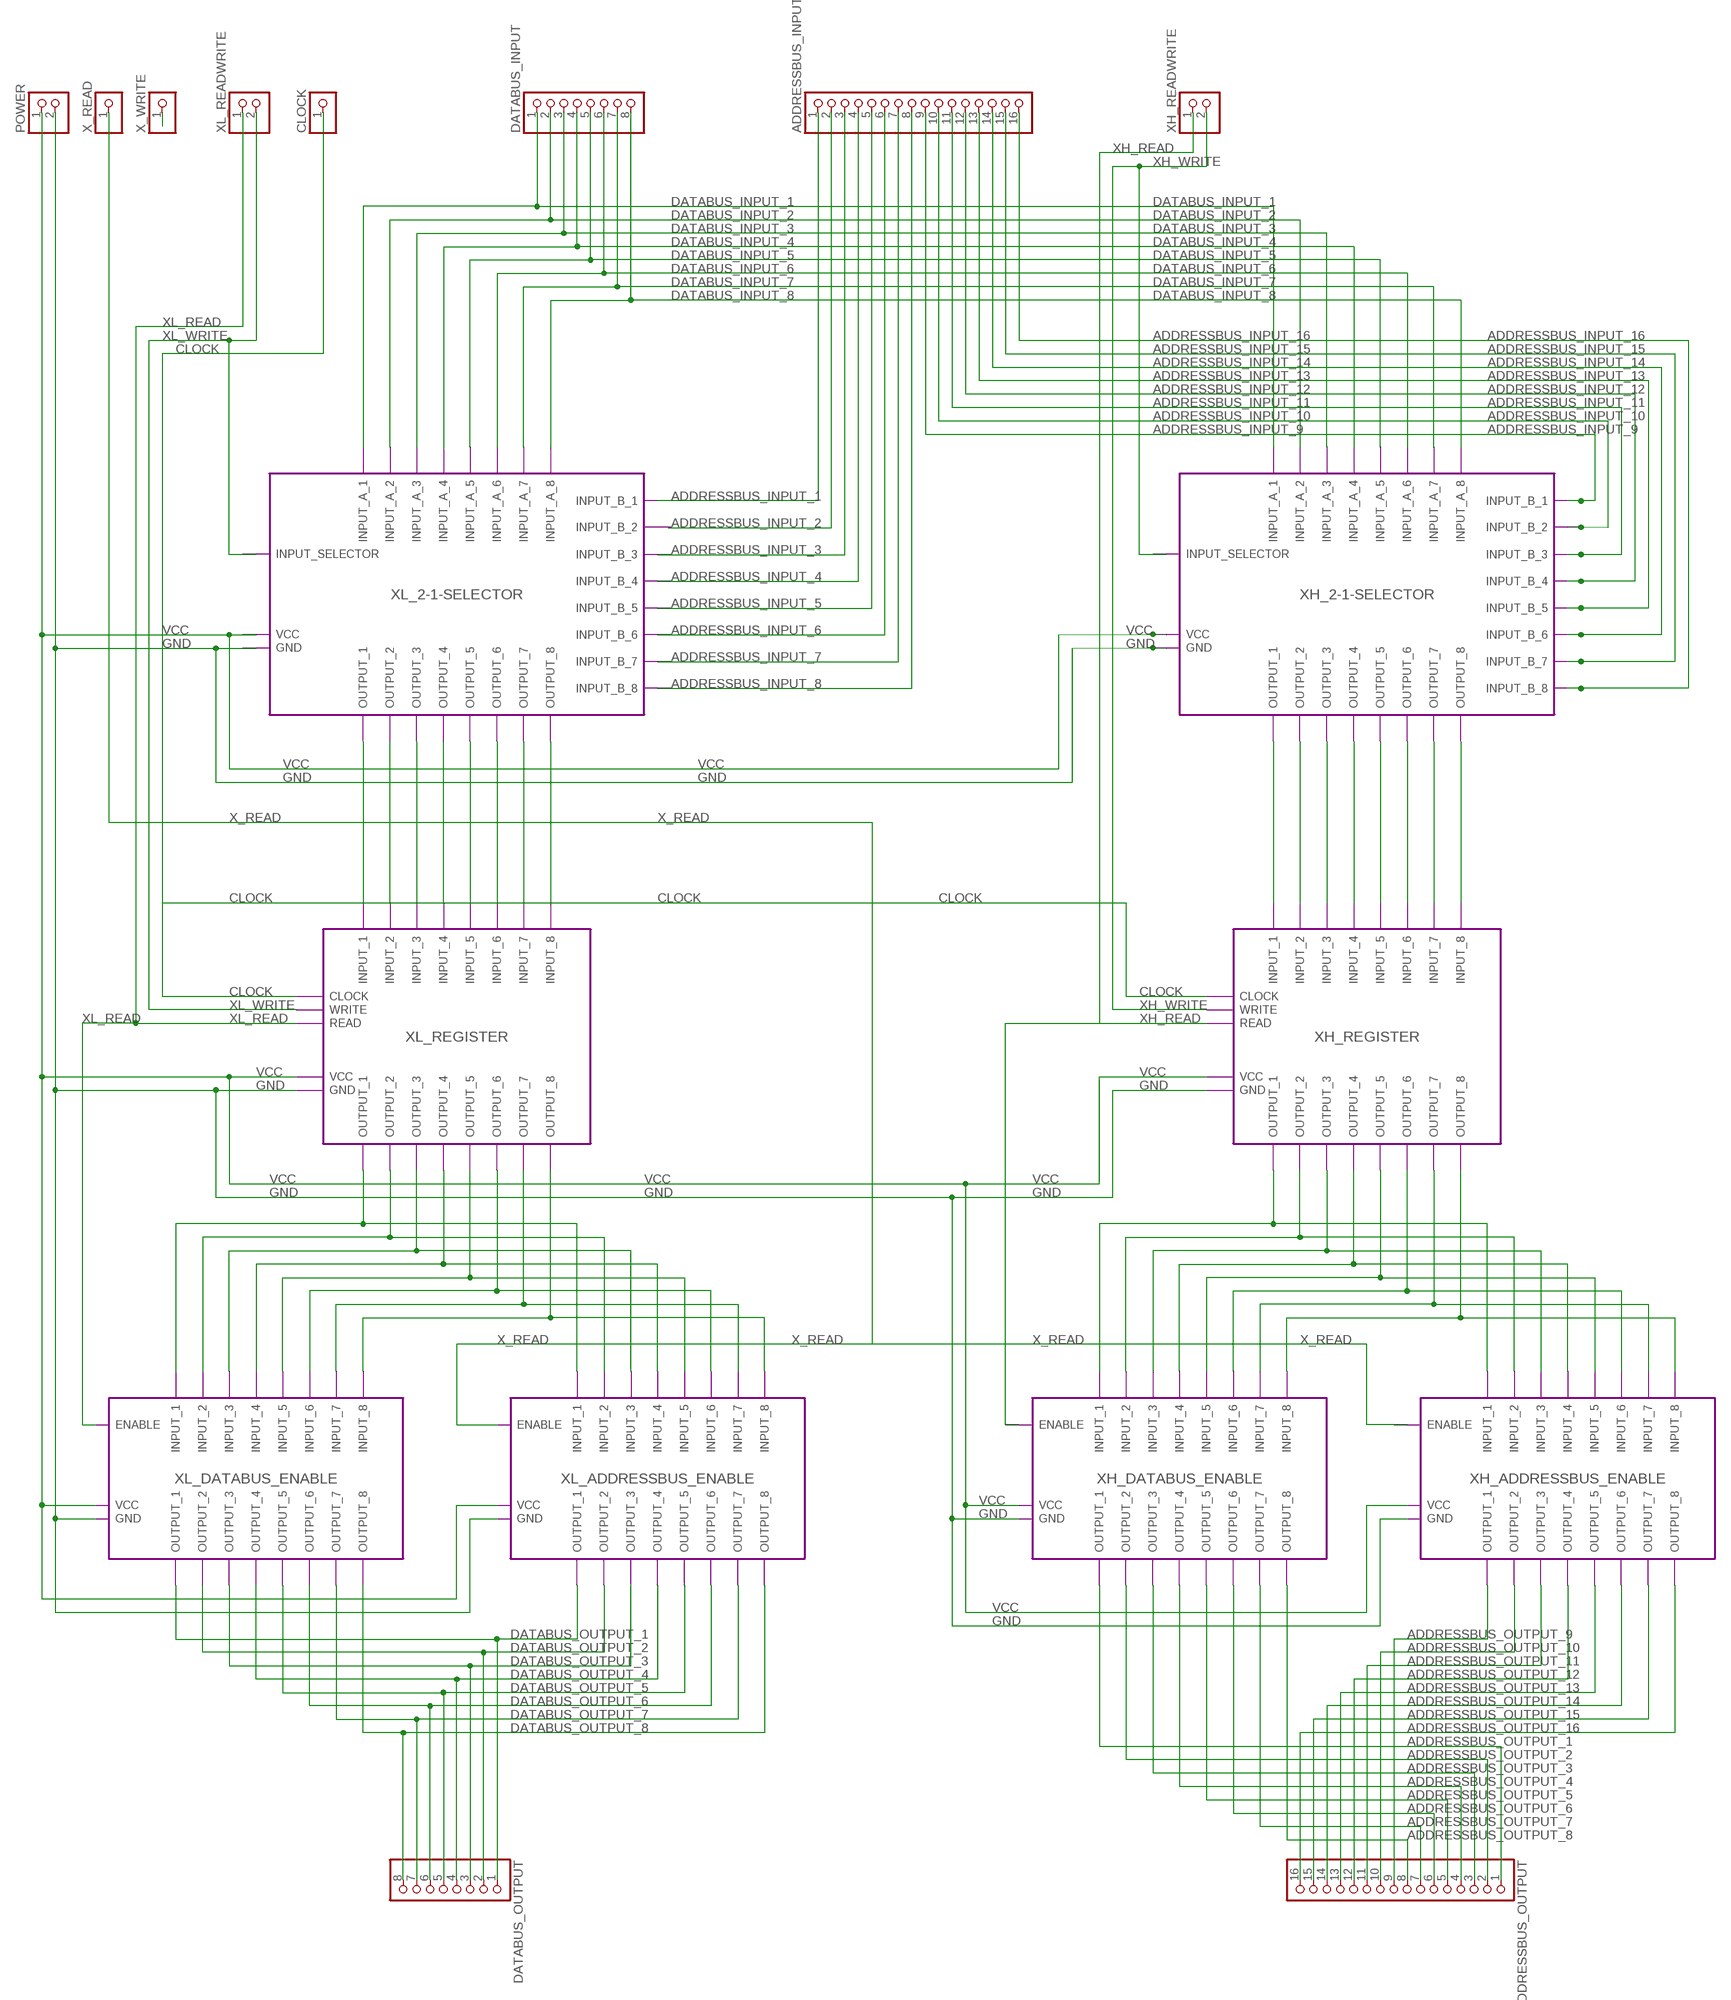
[diagram p14: schematic, module EXTENDED_REGISTER_16BIT, sheet 1]

### Parts
ADDRESSBUS_INPUT  PINHD-1X16  [1X16]
ADDRESSBUS_OUTPUT  PINHD-1X16  [1X16]
CLOCK  PINHD-1X1  [1X01]
DATABUS_INPUT  PINHD-1X8  [1X08]
DATABUS_OUTPUT  PINHD-1X8  [1X08]
POWER  PINHD-1X2  [1X02]
X_READ  PINHD-1X1  [1X01]
X_WRITE  PINHD-1X1  [1X01]
XH_READWRITE  PINHD-1X2  [1X02]
XL_READWRITE  PINHD-1X2  [1X02]

### Module instances
XH_2-1-SELECTOR = 2-1-SELECTOR
XL_2-1-SELECTOR = 2-1-SELECTOR
XL_DATABUS_ENABLE = BUS_ENABLE
XL_ADDRESSBUS_ENABLE = BUS_ENABLE
XH_DATABUS_ENABLE = BUS_ENABLE
XH_ADDRESSBUS_ENABLE = BUS_ENABLE
XL_REGISTER = REGISTER
XH_REGISTER = REGISTER

### Nets
ADDRESSBUS_INPUT_1: ADDRESSBUS_INPUT.1 ; port XL_2-1-SELECTOR.INPUT_B_1
ADDRESSBUS_INPUT_2: ADDRESSBUS_INPUT.2
ADDRESSBUS_INPUT_3: ADDRESSBUS_INPUT.3
ADDRESSBUS_INPUT_4: ADDRESSBUS_INPUT.4
ADDRESSBUS_INPUT_5: ADDRESSBUS_INPUT.5
ADDRESSBUS_INPUT_6: ADDRESSBUS_INPUT.6
ADDRESSBUS_INPUT_7: ADDRESSBUS_INPUT.7
ADDRESSBUS_INPUT_8: ADDRESSBUS_INPUT.8
ADDRESSBUS_INPUT_9: ADDRESSBUS_INPUT.9 ; port XH_2-1-SELECTOR.INPUT_B_1
ADDRESSBUS_INPUT_10: ADDRESSBUS_INPUT.10 ; port XH_2-1-SELECTOR.INPUT_B_2
ADDRESSBUS_INPUT_11: ADDRESSBUS_INPUT.11 ; port XH_2-1-SELECTOR.INPUT_B_3
ADDRESSBUS_INPUT_12: ADDRESSBUS_INPUT.12 ; port XH_2-1-SELECTOR.INPUT_B_4
ADDRESSBUS_INPUT_13: ADDRESSBUS_INPUT.13 ; port XH_2-1-SELECTOR.INPUT_B_5
ADDRESSBUS_INPUT_14: ADDRESSBUS_INPUT.14 ; port XH_2-1-SELECTOR.INPUT_B_6
ADDRESSBUS_INPUT_15: ADDRESSBUS_INPUT.15 ; port XH_2-1-SELECTOR.INPUT_B_7
ADDRESSBUS_INPUT_16: ADDRESSBUS_INPUT.16 ; port XH_2-1-SELECTOR.INPUT_B_8
ADDRESSBUS_OUTPUT_1: ADDRESSBUS_OUTPUT.1
ADDRESSBUS_OUTPUT_2: ADDRESSBUS_OUTPUT.2
ADDRESSBUS_OUTPUT_3: ADDRESSBUS_OUTPUT.3
ADDRESSBUS_OUTPUT_4: ADDRESSBUS_OUTPUT.4
ADDRESSBUS_OUTPUT_5: ADDRESSBUS_OUTPUT.5
ADDRESSBUS_OUTPUT_6: ADDRESSBUS_OUTPUT.6
ADDRESSBUS_OUTPUT_7: ADDRESSBUS_OUTPUT.7
ADDRESSBUS_OUTPUT_8: ADDRESSBUS_OUTPUT.8
ADDRESSBUS_OUTPUT_9: ADDRESSBUS_OUTPUT.9
ADDRESSBUS_OUTPUT_10: ADDRESSBUS_OUTPUT.10
ADDRESSBUS_OUTPUT_11: ADDRESSBUS_OUTPUT.11
ADDRESSBUS_OUTPUT_12: ADDRESSBUS_OUTPUT.12
ADDRESSBUS_OUTPUT_13: ADDRESSBUS_OUTPUT.13
ADDRESSBUS_OUTPUT_14: ADDRESSBUS_OUTPUT.14
ADDRESSBUS_OUTPUT_15: ADDRESSBUS_OUTPUT.15
ADDRESSBUS_OUTPUT_16: ADDRESSBUS_OUTPUT.16
CLOCK: CLOCK.1 ; port XL_REGISTER.CLOCK XH_REGISTER.CLOCK
DATABUS_INPUT_1: DATABUS_INPUT.1
DATABUS_INPUT_2: DATABUS_INPUT.2
DATABUS_INPUT_3: DATABUS_INPUT.3
DATABUS_INPUT_4: DATABUS_INPUT.4
DATABUS_INPUT_5: DATABUS_INPUT.5
DATABUS_INPUT_6: DATABUS_INPUT.6
DATABUS_INPUT_7: DATABUS_INPUT.7
DATABUS_INPUT_8: DATABUS_INPUT.8
DATABUS_OUTPUT_1: DATABUS_OUTPUT.1
DATABUS_OUTPUT_2: DATABUS_OUTPUT.2
DATABUS_OUTPUT_3: DATABUS_OUTPUT.3
DATABUS_OUTPUT_4: DATABUS_OUTPUT.4
DATABUS_OUTPUT_5: DATABUS_OUTPUT.5
DATABUS_OUTPUT_6: DATABUS_OUTPUT.6
DATABUS_OUTPUT_7: DATABUS_OUTPUT.7
DATABUS_OUTPUT_8: DATABUS_OUTPUT.8
GND: POWER.2 ; port XL_REGISTER.GND XH_REGISTER.GND XH_2-1-SELECTOR.GND XL_2-1-SELECTOR.GND
N$29: port XL_2-1-SELECTOR.INPUT_A_4
N$30: port XL_2-1-SELECTOR.INPUT_B_2
N$31: port XL_2-1-SELECTOR.INPUT_B_3
N$32: port XL_2-1-SELECTOR.INPUT_B_4
N$33: port XL_2-1-SELECTOR.INPUT_B_5
N$34: port XL_2-1-SELECTOR.INPUT_B_6
N$35: port XL_2-1-SELECTOR.INPUT_B_7
N$36: port XL_2-1-SELECTOR.INPUT_B_8
N$37: port XL_REGISTER.INPUT_1
N$38: port XL_REGISTER.INPUT_2
N$39: port XL_REGISTER.INPUT_3
N$40: port XL_REGISTER.INPUT_4
N$41: port XL_REGISTER.INPUT_5
N$42: port XL_REGISTER.INPUT_6
N$43: port XL_REGISTER.INPUT_7
N$44: port XL_REGISTER.INPUT_8
N$45: port XH_REGISTER.INPUT_1
N$46: port XH_REGISTER.INPUT_2
N$47: port XH_REGISTER.INPUT_3
N$48: port XH_REGISTER.INPUT_4
N$49: port XH_REGISTER.INPUT_5
N$50: port XH_REGISTER.INPUT_6
N$51: port XH_REGISTER.INPUT_7
N$52: port XH_REGISTER.INPUT_8
N$54: port XL_REGISTER.OUTPUT_1
N$56: port XL_REGISTER.OUTPUT_2
N$57: port XL_REGISTER.OUTPUT_3
N$58: port XL_REGISTER.OUTPUT_4
N$59: port XL_REGISTER.OUTPUT_5
N$60: port XL_REGISTER.OUTPUT_6
N$61: port XL_REGISTER.OUTPUT_7
N$62: port XL_REGISTER.OUTPUT_8
N$65: port XH_REGISTER.OUTPUT_1
N$66: port XH_REGISTER.OUTPUT_2
N$67: port XH_REGISTER.OUTPUT_3
N$68: port XH_REGISTER.OUTPUT_4
N$69: port XH_REGISTER.OUTPUT_5
N$70: port XH_REGISTER.OUTPUT_6
N$71: port XH_REGISTER.OUTPUT_7
N$72: port XH_REGISTER.OUTPUT_8
VCC: POWER.1 ; port XL_REGISTER.VCC XL_2-1-SELECTOR.VCC XH_REGISTER.VCC XH_2-1-SELECTOR.VCC
X_READ: X_READ.1
X_WRITE: X_WRITE.1
XH_READ: XH_READWRITE.1 ; port XH_REGISTER.READ
XH_WRITE: XH_READWRITE.2 ; port XH_REGISTER.WRITE
XL_READ: XL_READWRITE.1 ; port XL_REGISTER.READ
XL_WRITE: XL_READWRITE.2 ; port XL_REGISTER.WRITE XL_2-1-SELECTOR.INPUT_SELECTOR

### Library data of the parts
ADDRESSBUS_INPUT ADDRESSBUS_OUTPUT = pinhead:PINHD-1X16: PIN HEADER
CLOCK X_READ X_WRITE = pinhead:PINHD-1X1: PIN HEADER
DATABUS_INPUT DATABUS_OUTPUT = pinhead:PINHD-1X8: PIN HEADER
POWER XH_READWRITE XL_READWRITE = pinhead:PINHD-1X2: PIN HEADER